# EAGLE design drivebay pm (EAGLE 5.11)

## Sheet 1 of 4
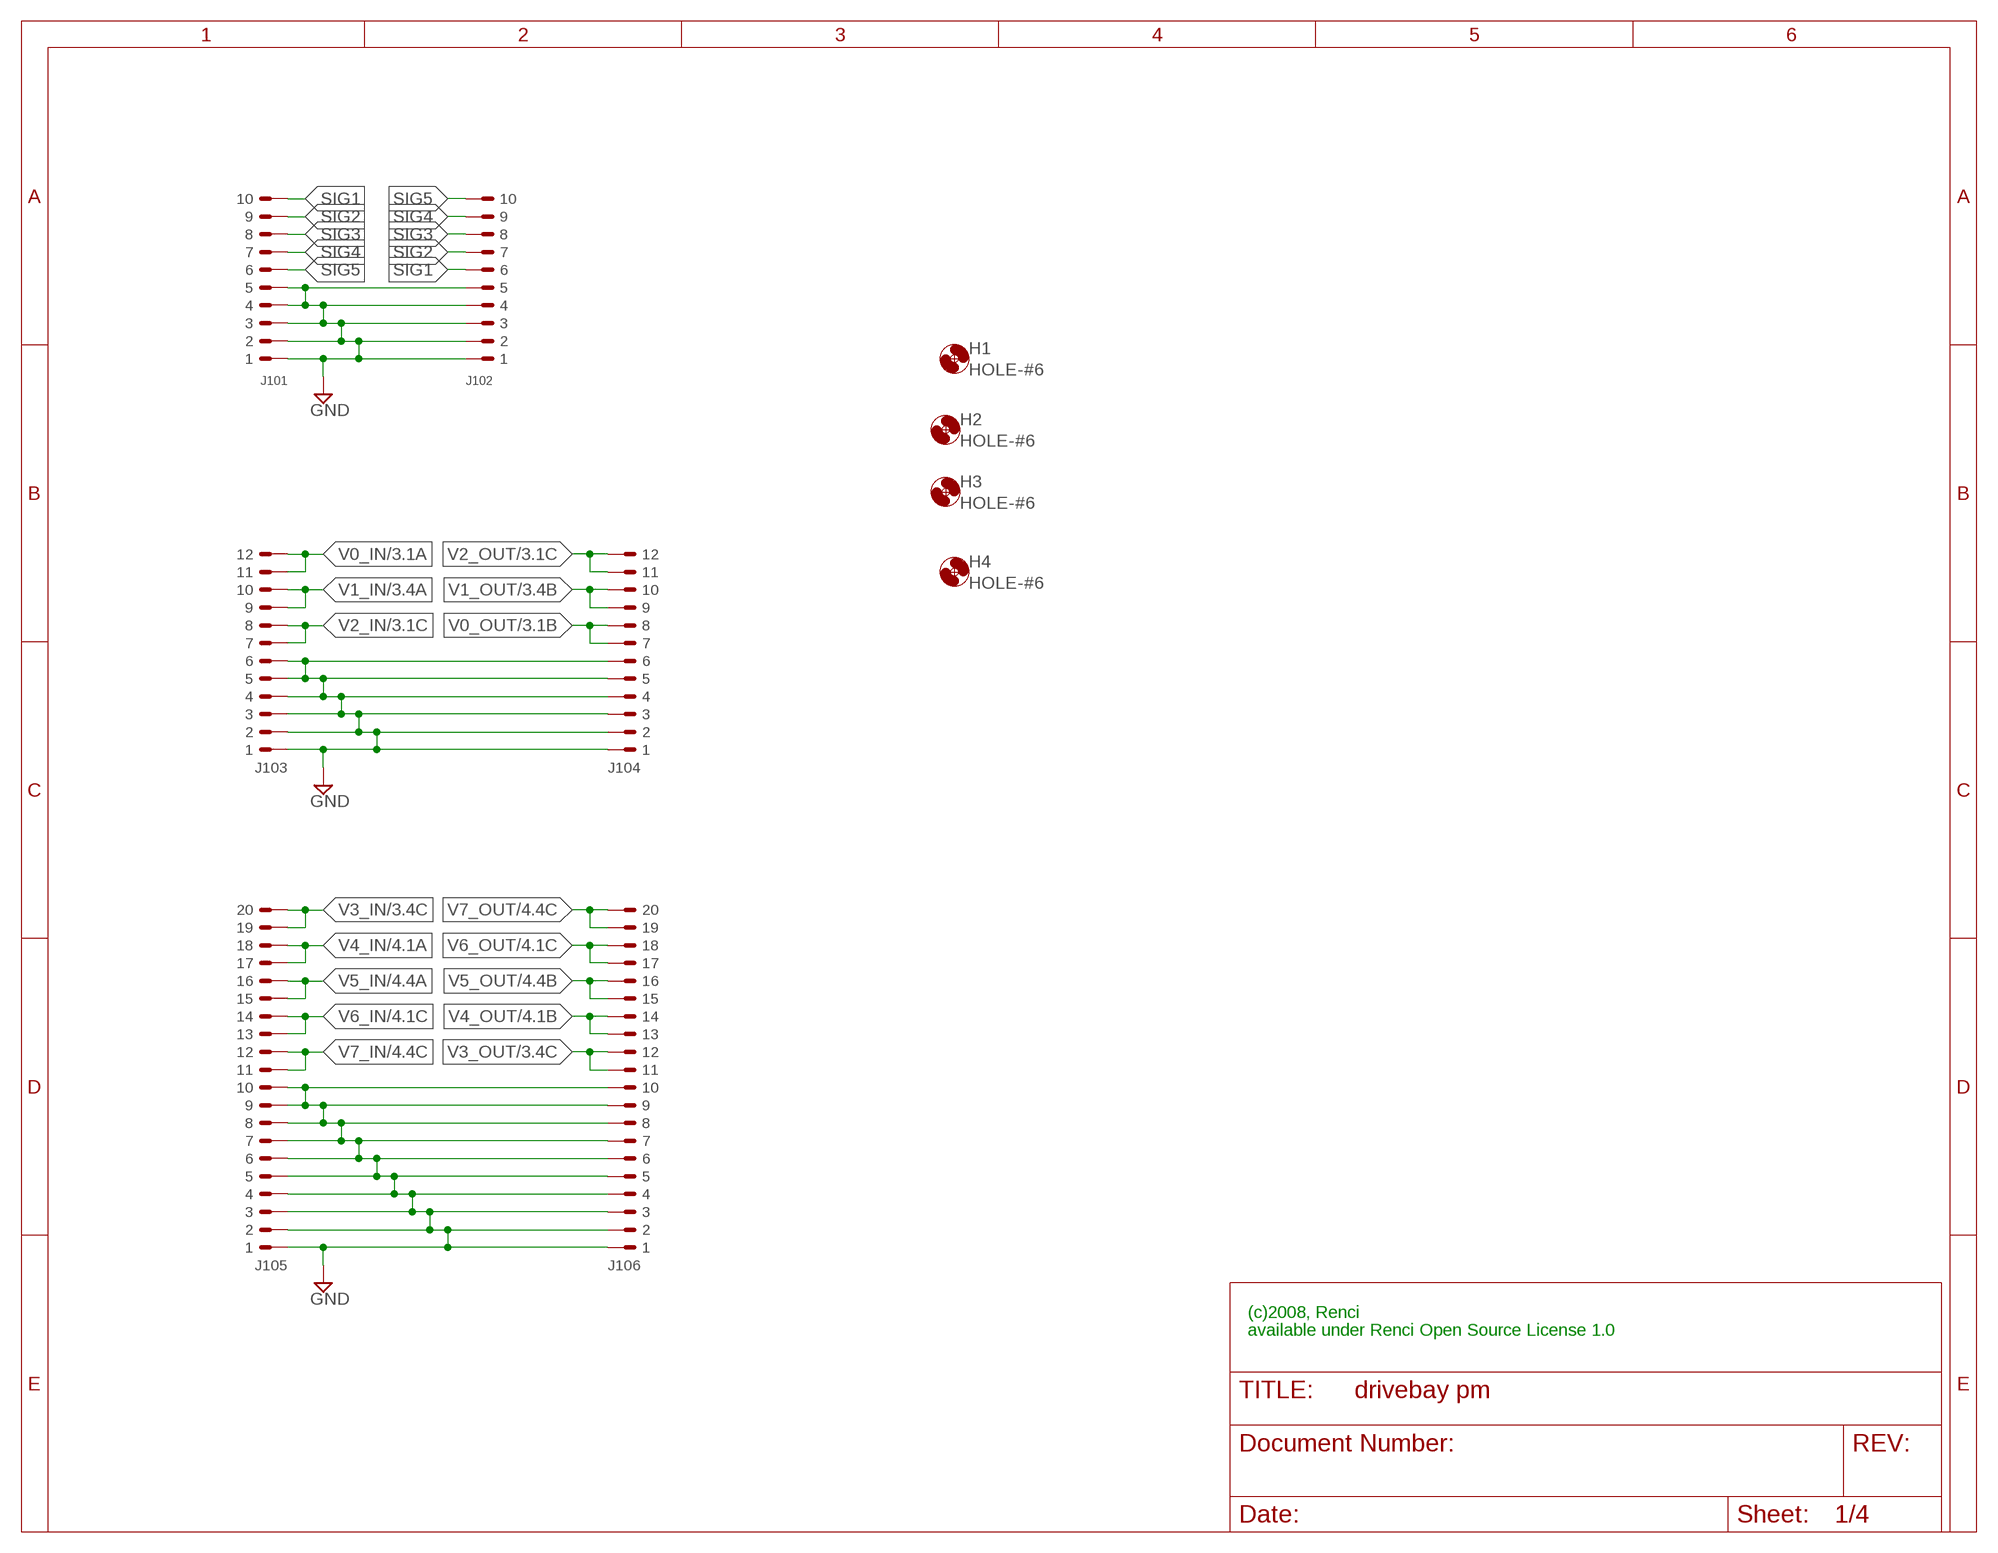
[diagram p0: schematic, sheet 1]

### Parts
H1  HOLE-#6  [HOLE-#6]
H2  HOLE-#6  [HOLE-#6]
H3  HOLE-#6  [HOLE-#6]
H4  HOLE-#6  [HOLE-#6]
J101  43045-10?  43045-10  [43045-10??]
J102  43045-10?  43045-10  [43045-10??]
J103  43045-12?  43045-12  [43045-12??]
J104  43045-12?  43045-12  [43045-12??]
J105  43045-20?  43045-20  [43045-20??]
J106  43045-20?  43045-20  [43045-20??]

### Nets
GND: J101.1 J101.2 J101.3 J101.4 J101.5 J102.1 J102.2 J102.3 J102.4 J102.5 J103.1 J103.2 J103.3 J103.4 J103.5 J103.6 J104.1 J104.2 J104.3 J104.4 J104.5 J104.6 J105.1 J105.2 J105.3 J105.4 J105.5 J105.6 J105.7 J105.8 J105.9 J105.10 J106.1 J106.2 J106.3 J106.4 J106.5 J106.6 J106.7 J106.8 J106.9 J106.10 ; also sheet 2,3,4
SIG1: J101.10 J102.6
SIG2: J101.9 J102.7
SIG3: J101.8 J102.8
SIG4: J101.7 J102.9
SIG5: J101.6 J102.10
V0_IN: J103.11 J103.12 ; also sheet 3
V0_OUT: J104.7 J104.8 ; also sheet 3
V1_IN: J103.9 J103.10 ; also sheet 3
V1_OUT: J104.9 J104.10 ; also sheet 3
V2_IN: J103.7 J103.8 ; also sheet 3
V2_OUT: J104.11 J104.12 ; also sheet 3
V3_IN: J105.19 J105.20 ; also sheet 3
V3_OUT: J106.11 J106.12 ; also sheet 3
V4_IN: J105.17 J105.18 ; also sheet 4
V4_OUT: J106.13 J106.14 ; also sheet 4
V5_IN: J105.15 J105.16 ; also sheet 4
V5_OUT: J106.15 J106.16 ; also sheet 4
V6_IN: J105.13 J105.14 ; also sheet 4
V6_OUT: J106.17 J106.18 ; also sheet 4
V7_IN: J105.11 J105.12 ; also sheet 4
V7_OUT: J106.19 J106.20 ; also sheet 4

### Notes on the sheet
- (c)2008, Renci
- available under Renci Open Source License 1.0

## Sheet 2 of 4
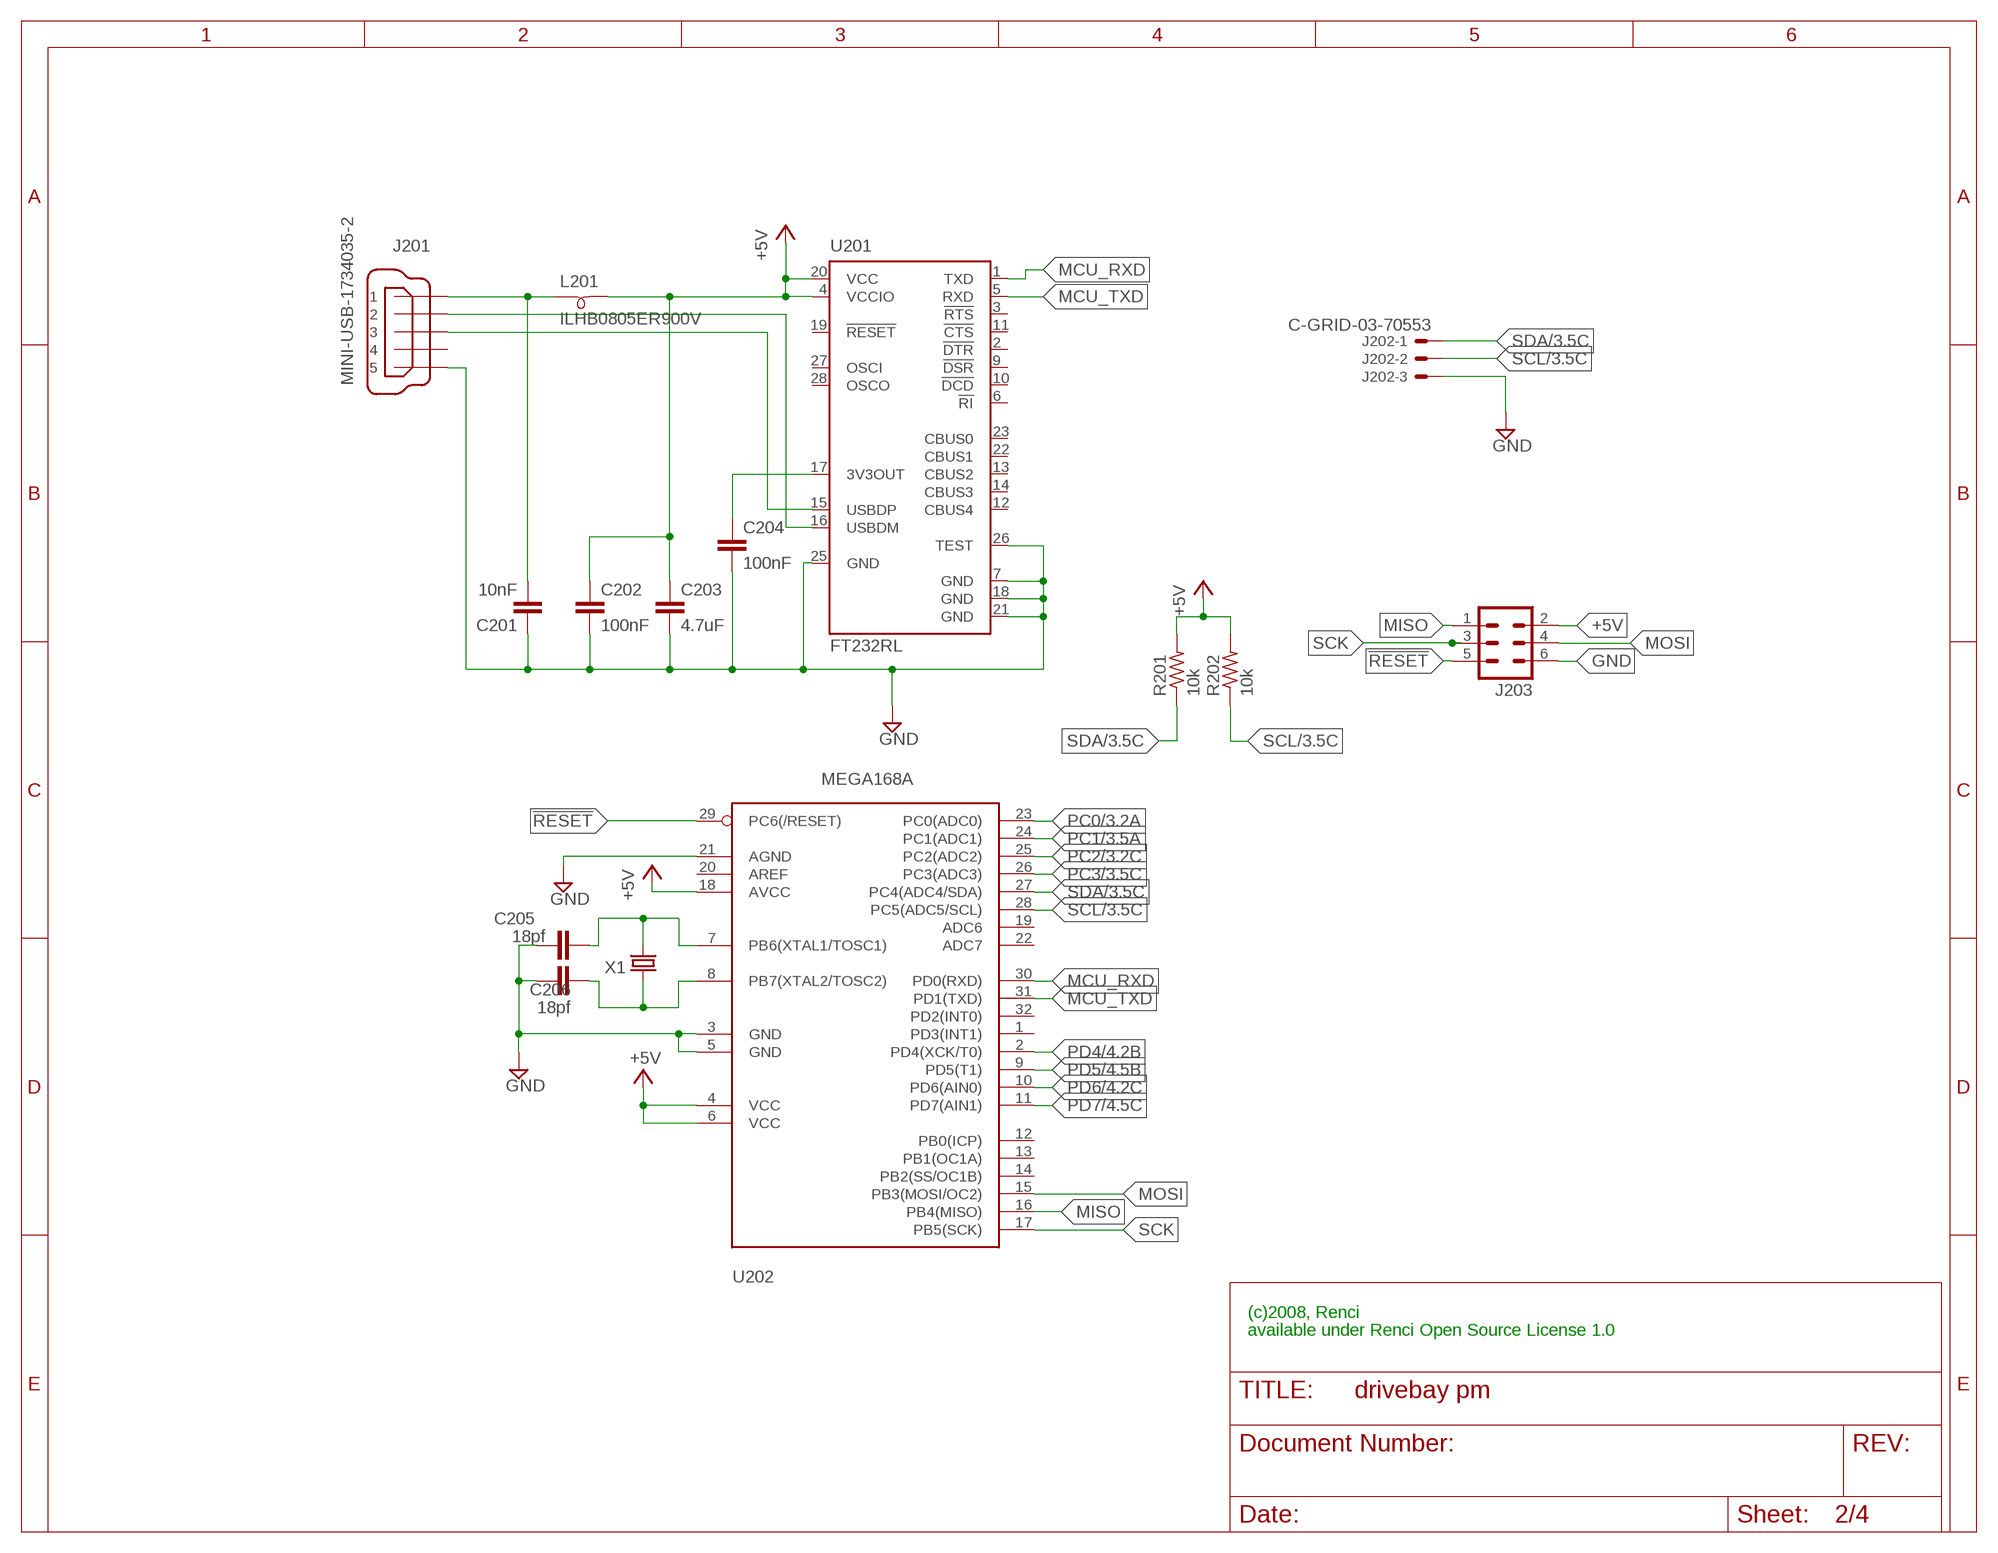
[diagram p1: schematic, sheet 2]

### Parts
C201  10nF  C-EUC0805  [C0805]
C202  100nF  C-EUC0805  [C0805]
C203  4.7uF  C-EUC0805  [C0805]
C204  100nF  C-EUC0805  [C0805]
C205  18pf  C-EUC0805  [C0805]
C206  18pf  C-EUC0805  [C0805]
J201  MINI-USB-1734035-2  [1734035-2]
J202  C-GRID-03-70553  [70553-03]
J203  MA03-2  [MA03-2]
L201  ILHB0805ER900V  [L0805]
R201  10k  R-US_R0805  [R0805]
R202  10k  R-US_R0805  [R0805]
U201  FT232RL  [SSOP28]
U202  MEGA168A  [TQFP32-08]
X1  MC-306  [MC-306]

### Nets
!RESET: J203.5 U202.29(PC6(/RESET))
+5V: C202.1 C203.1 J203.2 L201.2 R201.2 R202.2 U201.4(VCCIO) U201.20(VCC) U202.4(VCC) U202.6(VCC) U202.18(AVCC) ; also sheet 3,4
GND: C201.1 C202.2 C203.2 C204.2 C205.2 C206.2 J201.5 J202.3 J203.6 U201.7(GND) U201.18(GND) U201.21(GND) U201.25(GND) U201.26(TEST) U202.3(GND) U202.5(GND) U202.21(AGND) ; also sheet 1,3,4
MCU_RXD: U201.1(TXD) U202.30(PD0(RXD))
MCU_TXD: U201.5(RXD) U202.31(PD1(TXD))
MISO: J203.1 U202.16(PB4(MISO))
MOSI: J203.4 U202.15(PB3(MOSI/OC2))
N$12: C204.1 U201.17(3V3OUT)
N$13: C201.2 J201.1 L201.1
N$14: J201.2 U201.16(USBDM)
N$15: J201.3 U201.15(USBDP)
N$16: C205.1 U202.7(PB6(XTAL1/TOSC1)) X1.4
N$17: C206.1 U202.8(PB7(XTAL2/TOSC2)) X1.1
PC0: U202.23(PC0(ADC0)) ; also sheet 3
PC1: U202.24(PC1(ADC1)) ; also sheet 3
PC2: U202.25(PC2(ADC2)) ; also sheet 3
PC3: U202.26(PC3(ADC3)) ; also sheet 3
PD4: U202.2(PD4(XCK/T0)) ; also sheet 4
PD5: U202.9(PD5(T1)) ; also sheet 4
PD6: U202.10(PD6(AIN0)) ; also sheet 4
PD7: U202.11(PD7(AIN1)) ; also sheet 4
SCK: J203.3 U202.17(PB5(SCK))
SCL: J202.2 R202.1 U202.28(PC5(ADC5/SCL)) ; also sheet 3,4
SDA: J202.1 R201.1 U202.27(PC4(ADC4/SDA)) ; also sheet 3,4
Unconnected: J201.4 U201.2(!DTR) U201.3(!RTS) U201.6(!RI) U201.9(!DSR) U201.10(!DCD) U201.11(!CTS) U201.12(CBUS4) U201.13(CBUS2) U201.14(CBUS3) U201.19(!RESET) U201.22(CBUS1) U201.23(CBUS0) U201.27(OSCI) U201.28(OSCO) U202.1(PD3(INT1)) U202.12(PB0(ICP)) U202.13(PB1(OC1A)) U202.14(PB2(SS/OC1B)) U202.19(ADC6) U202.20(AREF) U202.22(ADC7) U202.32(PD2(INT0))

### Notes on the sheet
- (c)2008, Renci
- available under Renci Open Source License 1.0

## Sheet 3 of 4
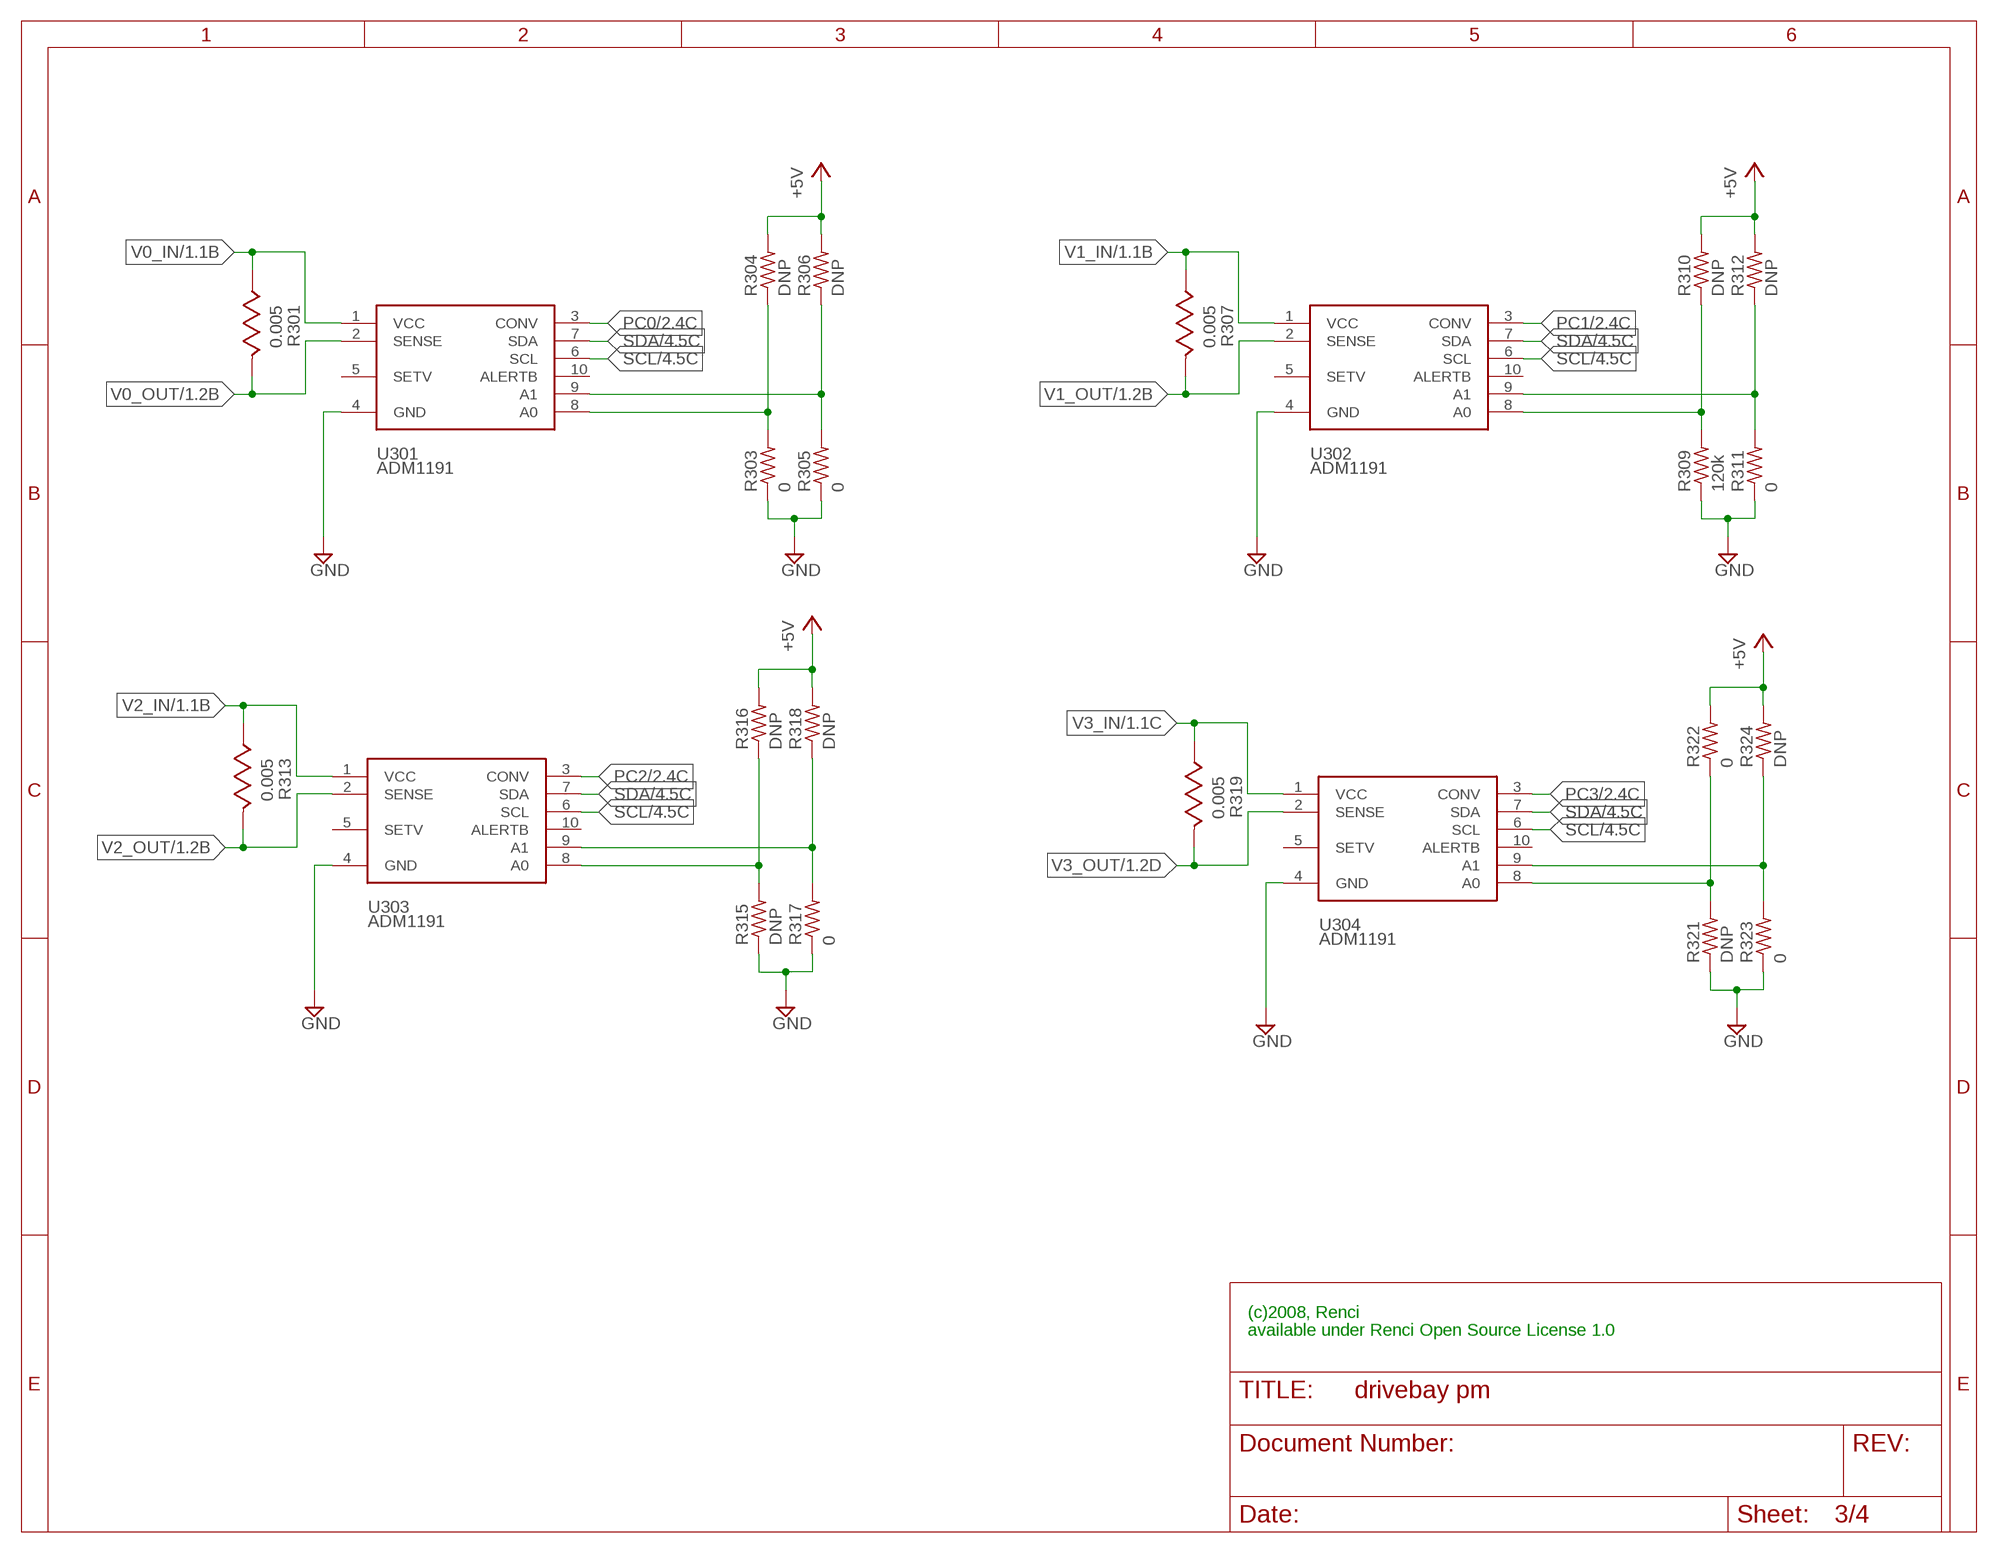
[diagram p2: schematic, sheet 3]

### Parts
R301  0.005  OARS-XP  [OARS-XP]
R303  0  R-US_R0603  [R0603]
R304  DNP  R-US_R0603  [R0603]
R305  0  R-US_R0603  [R0603]
R306  DNP  R-US_R0603  [R0603]
R307  0.005  OARS-XP  [OARS-XP]
R309  120k  R-US_R0603  [R0603]
R310  DNP  R-US_R0603  [R0603]
R311  0  R-US_R0603  [R0603]
R312  DNP  R-US_R0603  [R0603]
R313  0.005  OARS-XP  [OARS-XP]
R315  DNP  R-US_R0603  [R0603]
R316  DNP  R-US_R0603  [R0603]
R317  0  R-US_R0603  [R0603]
R318  DNP  R-US_R0603  [R0603]
R319  0.005  OARS-XP  [OARS-XP]
R321  DNP  R-US_R0603  [R0603]
R322  0  R-US_R0603  [R0603]
R323  0  R-US_R0603  [R0603]
R324  DNP  R-US_R0603  [R0603]
U301  ADM1191  [MSOP10]
U302  ADM1191  [MSOP10]
U303  ADM1191  [MSOP10]
U304  ADM1191  [MSOP10]

### Nets
+5V: R304.2 R306.2 R310.2 R312.2 R316.2 R318.2 R322.2 R324.2 ; also sheet 2,4
GND: R303.1 R305.1 R309.1 R311.1 R315.1 R317.1 R321.1 R323.1 U301.4(GND) U302.4(GND) U303.4(GND) U304.4(GND) ; also sheet 1,2,4
N$7: R315.2 R316.1 U303.8(A0)
N$9: R303.2 R304.1 U301.8(A0)
N$10: R305.2 R306.1 U301.9(A1)
N$11: R317.2 R318.1 U303.9(A1)
N$19: R321.2 R322.1 U304.8(A0)
N$20: R323.2 R324.1 U304.9(A1)
N$22: R309.2 R310.1 U302.8(A0)
N$23: R311.2 R312.1 U302.9(A1)
PC0: U301.3(CONV) ; also sheet 2
PC1: U302.3(CONV) ; also sheet 2
PC2: U303.3(CONV) ; also sheet 2
PC3: U304.3(CONV) ; also sheet 2
SCL: U301.6(SCL) U302.6(SCL) U303.6(SCL) U304.6(SCL) ; also sheet 2,4
SDA: U301.7(SDA) U302.7(SDA) U303.7(SDA) U304.7(SDA) ; also sheet 2,4
V0_IN: R301.P$1(A) U301.1(VCC) ; also sheet 1
V0_OUT: R301.P$2(E) U301.2(SENSE) ; also sheet 1
V1_IN: R307.P$1(A) U302.1(VCC) ; also sheet 1
V1_OUT: R307.P$2(E) U302.2(SENSE) ; also sheet 1
V2_IN: R313.P$1(A) U303.1(VCC) ; also sheet 1
V2_OUT: R313.P$2(E) U303.2(SENSE) ; also sheet 1
V3_IN: R319.P$1(A) U304.1(VCC) ; also sheet 1
V3_OUT: R319.P$2(E) U304.2(SENSE) ; also sheet 1
Unconnected: U301.5(SETV) U301.10(ALERTB) U302.5(SETV) U302.10(ALERTB) U303.5(SETV) U303.10(ALERTB) U304.5(SETV) U304.10(ALERTB)

### Notes on the sheet
- (c)2008, Renci
- available under Renci Open Source License 1.0

## Sheet 4 of 4
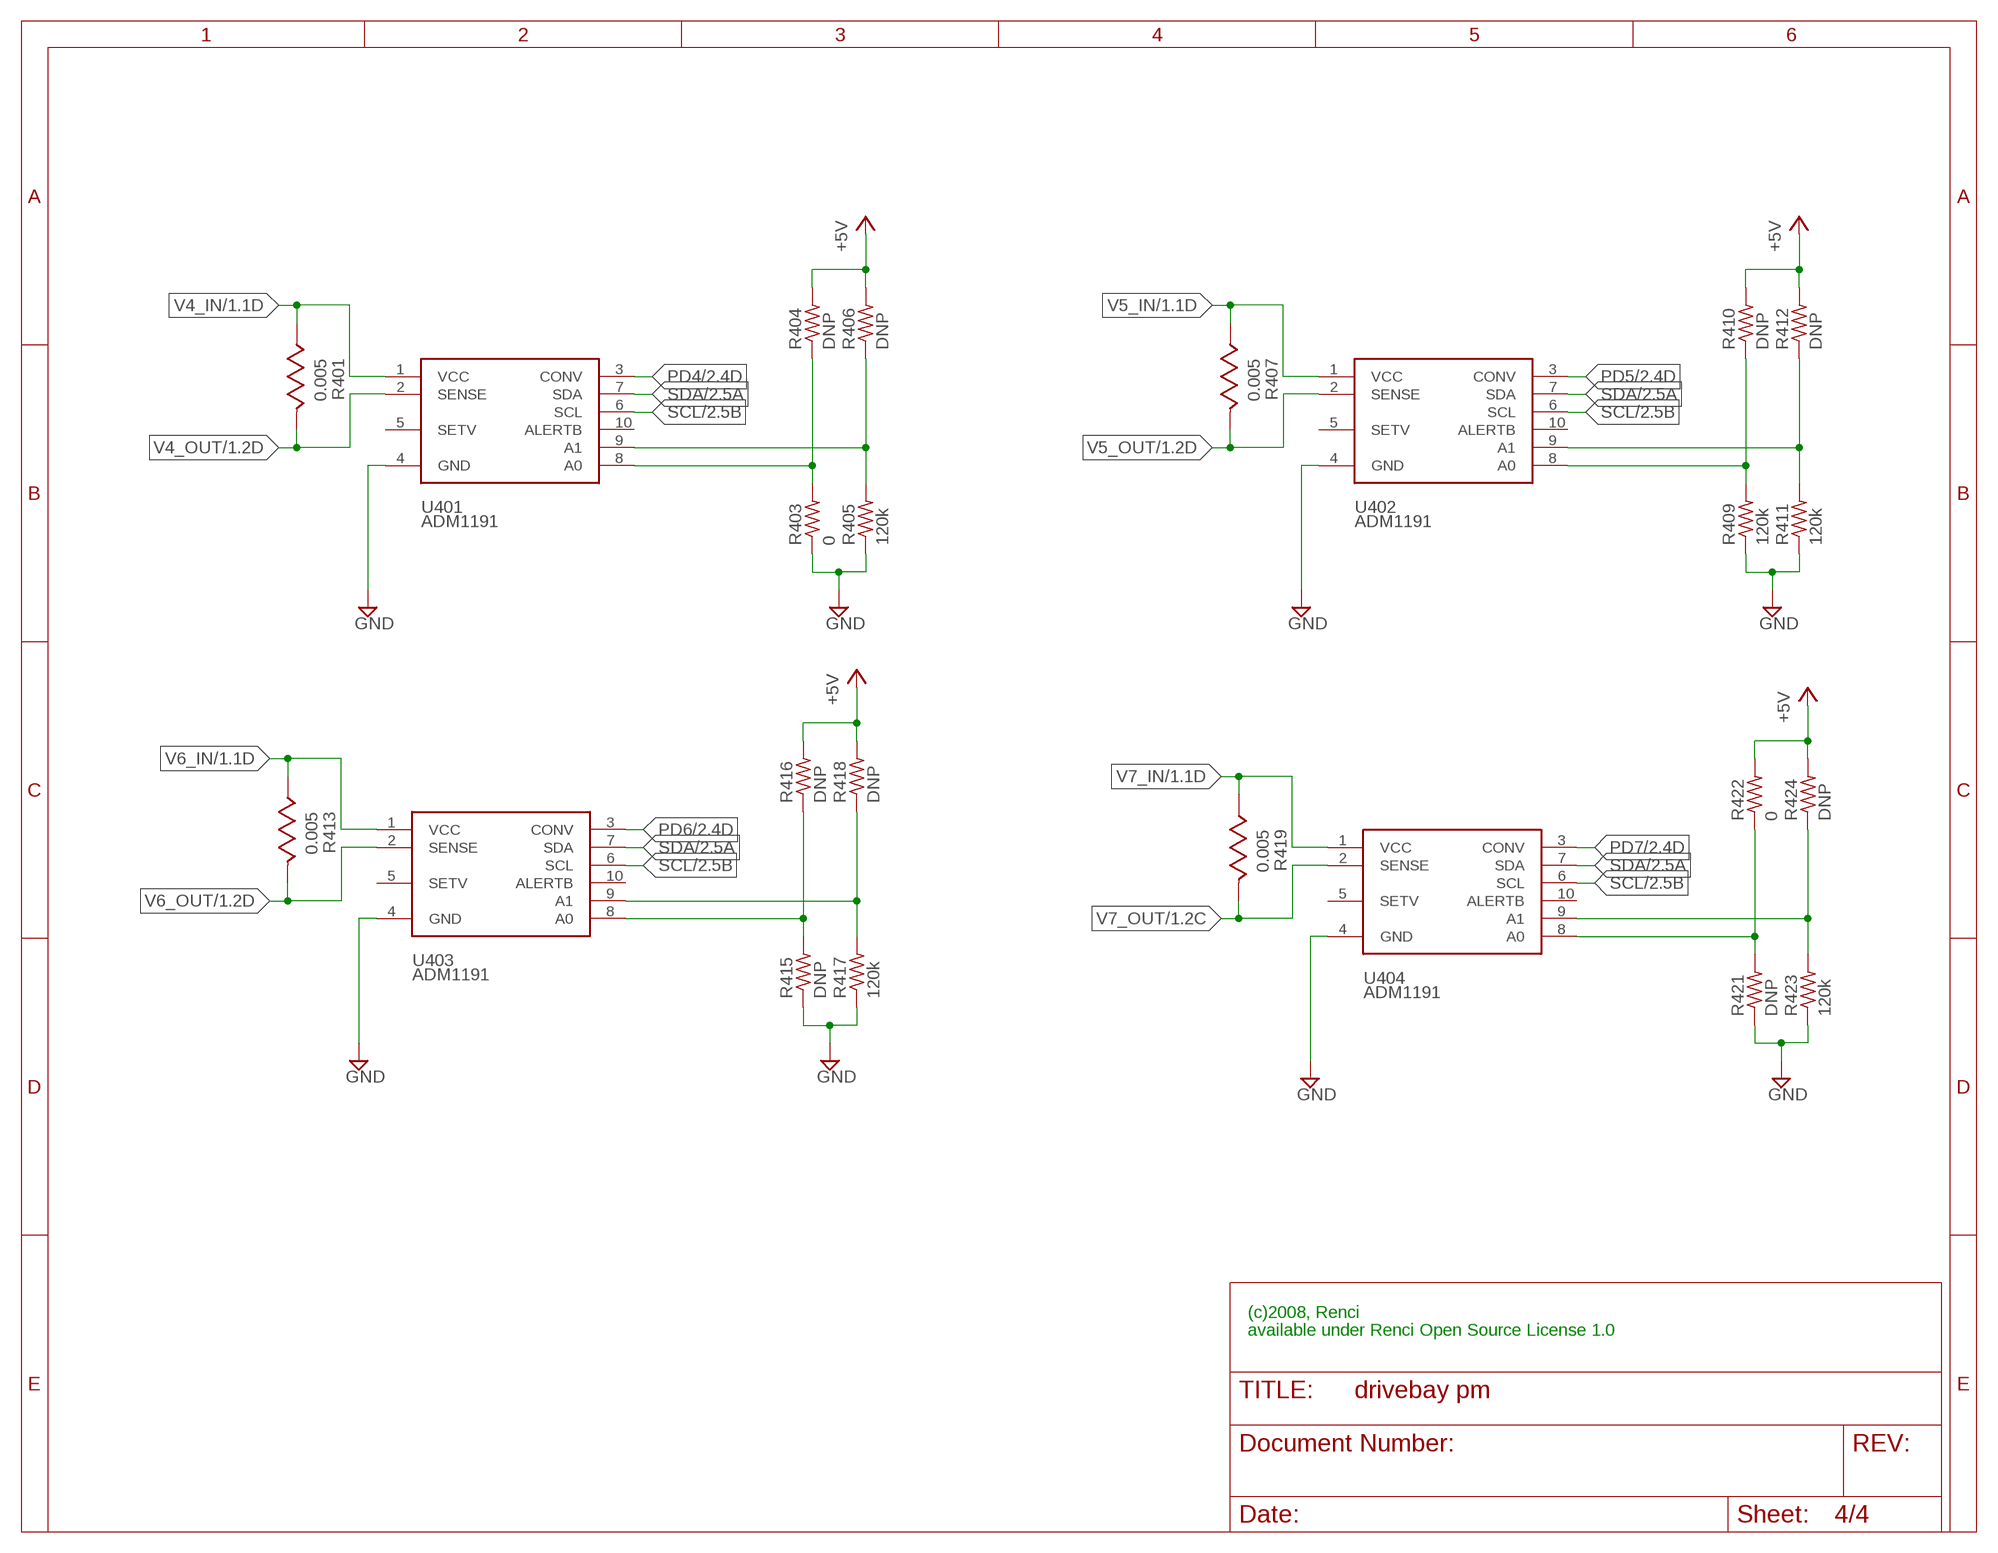
[diagram p3: schematic, sheet 4]

### Parts
R401  0.005  OARS-XP  [OARS-XP]
R403  0  R-US_R0603  [R0603]
R404  DNP  R-US_R0603  [R0603]
R405  120k  R-US_R0603  [R0603]
R406  DNP  R-US_R0603  [R0603]
R407  0.005  OARS-XP  [OARS-XP]
R409  120k  R-US_R0603  [R0603]
R410  DNP  R-US_R0603  [R0603]
R411  120k  R-US_R0603  [R0603]
R412  DNP  R-US_R0603  [R0603]
R413  0.005  OARS-XP  [OARS-XP]
R415  DNP  R-US_R0603  [R0603]
R416  DNP  R-US_R0603  [R0603]
R417  120k  R-US_R0603  [R0603]
R418  DNP  R-US_R0603  [R0603]
R419  0.005  OARS-XP  [OARS-XP]
R421  DNP  R-US_R0603  [R0603]
R422  0  R-US_R0603  [R0603]
R423  120k  R-US_R0603  [R0603]
R424  DNP  R-US_R0603  [R0603]
U401  ADM1191  [MSOP10]
U402  ADM1191  [MSOP10]
U403  ADM1191  [MSOP10]
U404  ADM1191  [MSOP10]

### Nets
+5V: R404.2 R406.2 R410.2 R412.2 R416.2 R418.2 R422.2 R424.2 ; also sheet 2,3
GND: R403.1 R405.1 R409.1 R411.1 R415.1 R417.1 R421.1 R423.1 U401.4(GND) U402.4(GND) U403.4(GND) U404.4(GND) ; also sheet 1,2,3
N$25: R403.2 R404.1 U401.8(A0)
N$26: R405.2 R406.1 U401.9(A1)
N$28: R415.2 R416.1 U403.8(A0)
N$29: R417.2 R418.1 U403.9(A1)
N$31: R421.2 R422.1 U404.8(A0)
N$32: R423.2 R424.1 U404.9(A1)
N$34: R409.2 R410.1 U402.8(A0)
N$35: R411.2 R412.1 U402.9(A1)
PD4: U401.3(CONV) ; also sheet 2
PD5: U402.3(CONV) ; also sheet 2
PD6: U403.3(CONV) ; also sheet 2
PD7: U404.3(CONV) ; also sheet 2
SCL: U401.6(SCL) U402.6(SCL) U403.6(SCL) U404.6(SCL) ; also sheet 2,3
SDA: U401.7(SDA) U402.7(SDA) U403.7(SDA) U404.7(SDA) ; also sheet 2,3
V4_IN: R401.P$1(A) U401.1(VCC) ; also sheet 1
V4_OUT: R401.P$2(E) U401.2(SENSE) ; also sheet 1
V5_IN: R407.P$1(A) U402.1(VCC) ; also sheet 1
V5_OUT: R407.P$2(E) U402.2(SENSE) ; also sheet 1
V6_IN: R413.P$1(A) U403.1(VCC) ; also sheet 1
V6_OUT: R413.P$2(E) U403.2(SENSE) ; also sheet 1
V7_IN: R419.P$1(A) U404.1(VCC) ; also sheet 1
V7_OUT: R419.P$2(E) U404.2(SENSE) ; also sheet 1
Unconnected: U401.5(SETV) U401.10(ALERTB) U402.5(SETV) U402.10(ALERTB) U403.5(SETV) U403.10(ALERTB) U404.5(SETV) U404.10(ALERTB)

### Notes on the sheet
- (c)2008, Renci
- available under Renci Open Source License 1.0

## Library data of the parts
C201-C206 = rcl:C-EU: CAPACITOR, European symbol
H1-H4 = renci:HOLE-#6
J101 J102 = renci:43045-10??
J103 J104 = renci:43045-12??
J105 J106 = renci:43045-20??
J201 = renci:MINI-USB-: MINI USB Connector Source: http://www.hirose.co.jp/cataloge_hp/e24000019.pdf
J202 = con-molex:C-GRID-03: CONNECTOR wire to board 2.54 mm (0.100") pitch header
J203 = con-lstb:MA03-2: PIN HEADER
L201 = renci:ILHB0805ER900V
R201 R202 R303-R306 R309-R312 R315-R318 R321-R324 R403-R406 R409-R412 R415-R418 R421-R424 = resistor:R-US_: RESISTOR, American symbol
R301 R307 R313 R319 R401 R407 R413 R419 = renci:OARS-XP
U201 = ftdichip:FT232R: Source: http://www.ftdichip.com/Documents/DataSheets/DS_FT232R_v104.pdf
U202 = renci:MEGA168
U301-U304 U401-U404 = renci:ADM1191
X1 = crystal:MC-306: kHz RANGE CRYSTAL UNIT SMD Source: MC-306_405_406_E07X.PDF Homepage <www.epsontoyocom.co.jp>; MPN: MC-306 60.0KHZ 100PPM ,12.5PF; OC_FARNELL: 1278040; OC_NEWARK: 31M5576

## Board
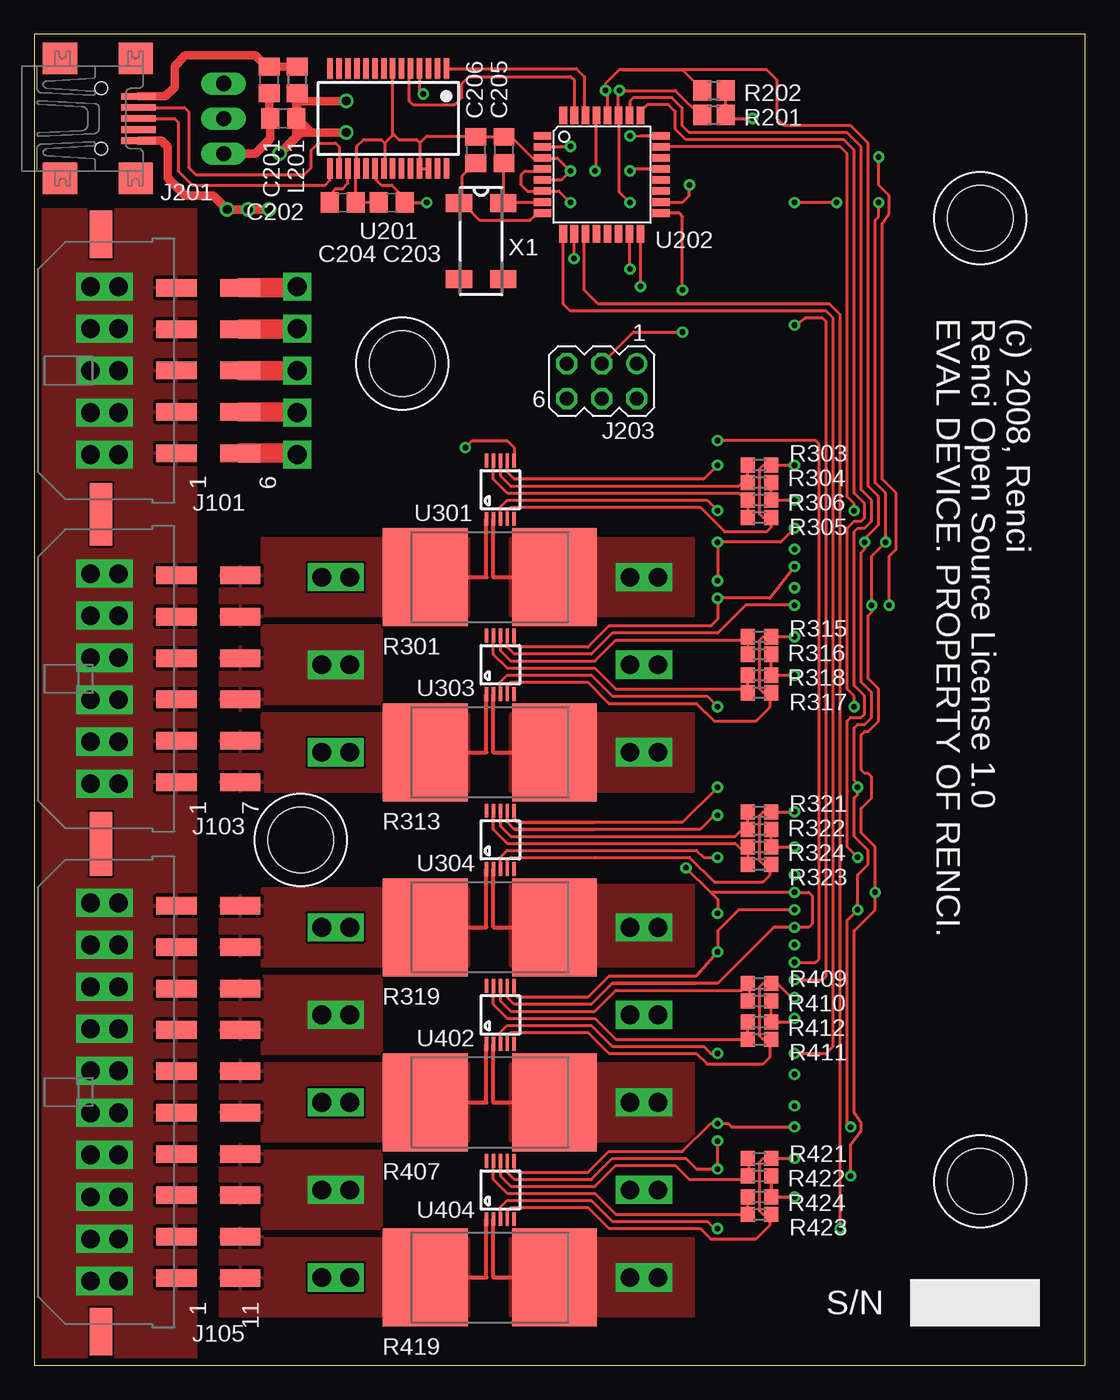
[diagram p4: board, top side]
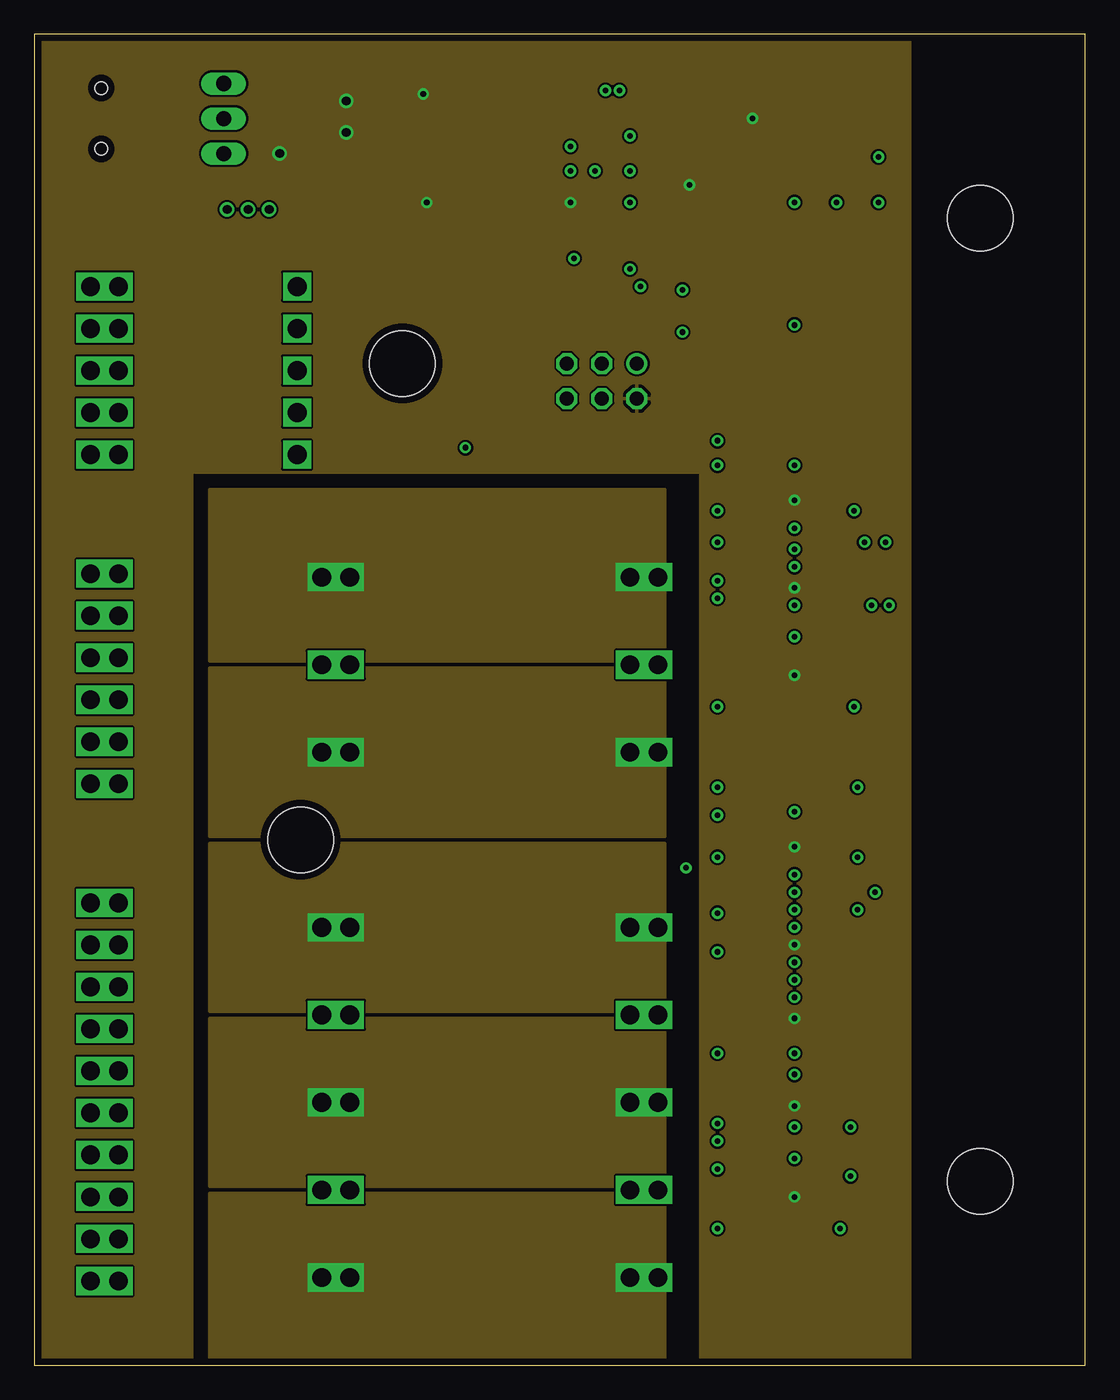
[diagram p5: board, inner layer Route2]
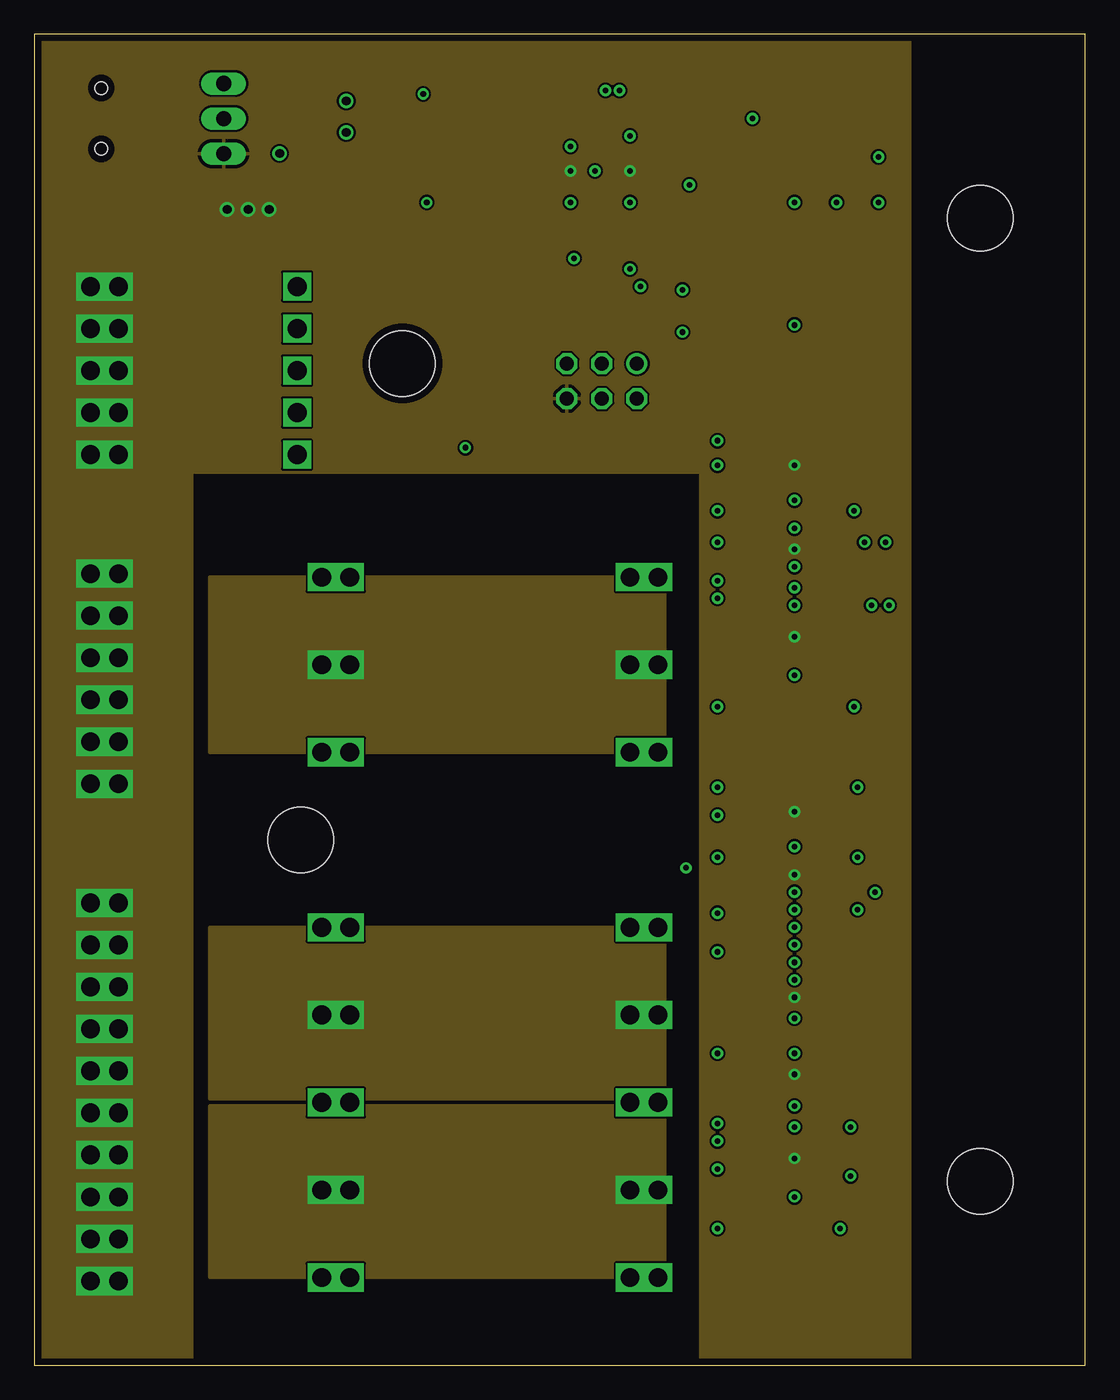
[diagram p6: board, inner layer Route15]
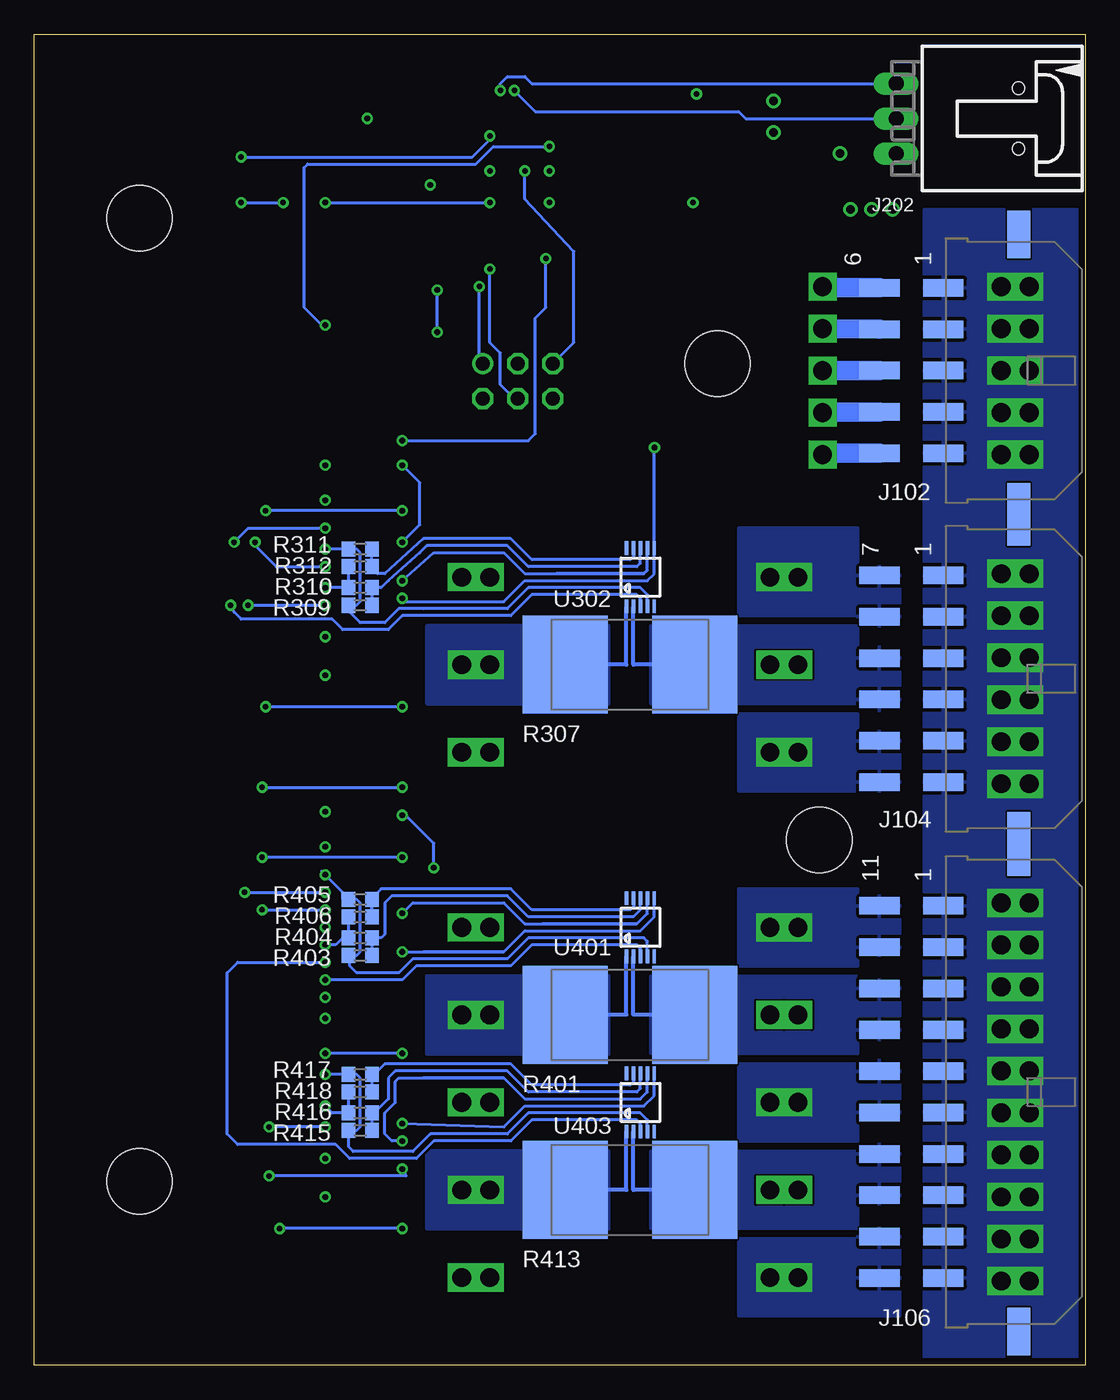
[diagram p7: board, bottom side, seen from below]

Size 76.2 x 96.52 mm. Coordinates in mm from the lower left corner, seen from the top.
Outline: 0,0 76.2,0 76.2,96.52 0,96.52 0,0
Copper layers (1+2*15+16): Top 0.0178mm / dielectric 0.3048mm / Route2 0.0356mm / dielectric 0.7112mm / Route15 0.0356mm / dielectric 0.3048mm / Bottom 0.0178mm
Design rules "SSC-EAGLE-4Lyr_v1.0.0.3 *": minimum track width 6mil, minimum drill 8mil, track to track 6mil, track to pad 6mil, pad to pad 6mil, via to via 6mil, smd to smd 6mil, copper to edge 20mil, drill to drill 16mil, minimum pad ring 8mil, minimum via ring 8mil, stop-mask expansion 2mil, vias tented up to drill 25mil, thermal gap 10mil

### Footprints (pad centres in the part's own frame; a part is rotated, then mirrored left to right if it is on the bottom)
C0805 = smd 1.3 x 1.5: 1 -0.95,0; 2 0.95,0
HOLE-#6 = hole 4.75: 0,0
43045-10?? = smd 1.27 x 2.92: 1 6,5.47; 2 3,5.47; 3 0,5.47; 4 -3,5.47; 5 -6,5.47; 6 6,10.1; 7 3,10.1; 8 0,10.1; 9 -3,10.1; 10 -6,10.1 | smd 3.43 x 1.65: P$1 -9.885,0; P$2 9.885,0
43045-12?? = smd 1.27 x 2.92: 1 7.5,5.47; 2 4.5,5.47; 3 1.5,5.47; 4 -1.5,5.47; 5 -4.5,5.47; 6 -7.5,5.47; 7 7.5,10.1; 8 4.5,10.1; 9 1.5,10.1; 10 -1.5,10.1; 11 -4.5,10.1; 12 -7.5,10.1 | smd 3.43 x 1.65: P$1 -11.385,0; P$2 11.385,0
43045-20?? = smd 1.27 x 2.92: 1 13.5,5.47; 2 10.5,5.47; 3 7.5,5.47; 4 4.5,5.47; 5 1.5,5.47; 6 -1.5,5.47; 7 -4.5,5.47; 8 -7.5,5.47; 9 -10.5,5.47; 10 -13.5,5.47; 11 13.5,10.1; 12 10.5,10.1; 13 7.5,10.1; 14 4.5,10.1; 15 1.5,10.1; 16 -1.5,10.1; 17 -4.5,10.1; 18 -7.5,10.1; 19 -10.5,10.1; 20 -13.5,10.1 | smd 3.43 x 1.65: P$1 -17.385,0; P$2 17.385,0
1734035-2 = smd 2.5 x 0.5: 1 3.48,1.6; 2 3.48,0.8; 3 3.48,0; 4 3.48,-0.8; 5 3.48,-1.6 | smd 2.5 x 2.3: M1 -2.22,-4.35; M2 -2.22,4.35; M3 3.28,4.35; M4 3.28,-4.35 | hole 0.9: 0.78,-2.2; 0.78,2.2
70553-03 = drill 1.092 long: 1 -2.54,-7.62; 2 0,-7.62; 3 2.54,-7.62
MA03-2 = drill 1.016 round: 1 -2.54,-1.27 | drill 1.016 octagon: 2 -2.54,1.27; 3 0,-1.27; 4 0,1.27; 5 2.54,-1.27; 6 2.54,1.27
L0805 = smd 1.3 x 1.5: 1 -0.95,0; 2 0.95,0
R0805 = smd 1.3 x 1.5: 1 -0.85,0; 2 0.85,0
OARS-XP = smd 6.15 x 7.11: P$1 -4.69,0; P$2 4.69,0
R0603 = smd 1 x 1.1: 1 -0.85,0; 2 0.85,0
SSOP28 = smd 0.4 x 1.5: 1 -4.225,-3.625; 2 -3.575,-3.625; 3 -2.925,-3.625; 4 -2.275,-3.625; 5 -1.625,-3.625; 6 -0.975,-3.625; 7 -0.325,-3.625; 8 0.325,-3.625; 9 0.975,-3.625; 10 1.625,-3.625; 11 2.275,-3.625; 12 2.925,-3.625; 13 3.575,-3.625; 14 4.225,-3.625; 15 4.225,3.625; 16 3.575,3.625; 17 2.925,3.625; 18 2.275,3.625; 19 1.625,3.625; 20 0.975,3.625; 21 0.325,3.625; 22 -0.325,3.625; 23 -0.975,3.625; 24 -1.625,3.625; 25 -2.275,3.625; 26 -2.925,3.625; 27 -3.575,3.625; 28 -4.225,3.625
TQFP32-08 = smd 1.27 x 0.559: 1 -4.293,2.8; 2 -4.293,2; 3 -4.293,1.2; 4 -4.293,0.4; 5 -4.293,-0.4; 6 -4.293,-1.2; 7 -4.293,-2; 8 -4.293,-2.8; 17 4.293,-2.8; 18 4.293,-2; 19 4.293,-1.2; 20 4.293,-0.4; 21 4.293,0.4; 22 4.293,1.2; 23 4.293,2; 24 4.293,2.8 | smd 0.559 x 1.27: 9 -2.8,-4.293; 10 -2,-4.293; 11 -1.2,-4.293; 12 -0.4,-4.293; 13 0.4,-4.293; 14 1.2,-4.293; 15 2,-4.293; 16 2.8,-4.293; 25 2.8,4.293; 26 2,4.293; 27 1.2,4.293; 28 0.4,4.293; 29 -0.4,4.293; 30 -1.2,4.293; 31 -2,4.293; 32 -2.8,4.293
MSOP10 = smd 0.25 x 1: 1 -1,-2.113; 2 -0.5,-2.113; 3 0,-2.113; 4 0.5,-2.113; 5 1,-2.113; 6 1,2.113; 7 0.5,2.113; 8 0,2.113; 9 -0.5,2.113; 10 -1,2.113
MC-306 = smd 1.3 x 1.9: 1 -2.75,-1.6; 2 2.75,-1.6; 3 2.75,1.6; 4 -2.75,1.6

### Placement (x,y rotation side)
C201  17.02,93.22 90 top
C202  18.03,90.42 180 top
C203  25.91,84.33 180 top
C204  22.35,84.33 0 top
C205  34.04,88.14 90 top
C206  32,88.14 90 top
H1  68.58,83.19 0 top
H2  68.58,13.34 0 top
H3  26.67,72.64 0 top
H4  19.3,38.1 0 top
J101  4.83,72.14 270 top
J102  4.83,72.14 90 bottom
J103  4.83,49.78 270 top
J104  4.83,49.78 90 bottom
J105  4.83,19.81 270 top
J106  4.83,19.81 90 bottom
J201  4.06,90.42 0 top
J202  6.1,90.42 270 bottom
J203  41.15,71.37 180 top
L201  19.05,93.22 270 top
R201  49.28,90.68 0 top
R202  49.28,92.46 0 top
R301  33.02,57.15 0 top
R303  52.58,65.28 180 top
R304  52.58,64.01 0 top
R305  52.58,61.47 180 top
R306  52.58,62.74 0 top
R307  33.02,50.8 0 bottom
R309  52.58,55.12 0 bottom
R310  52.58,56.39 180 bottom
R311  52.58,59.18 0 bottom
R312  52.58,57.91 180 bottom
R313  33.02,44.45 0 top
R315  52.58,52.83 180 top
R316  52.58,51.56 0 top
R317  52.58,48.77 180 top
R318  52.58,50.04 0 top
R319  33.02,31.75 0 top
R321  52.58,40.13 180 top
R322  52.58,38.86 0 top
R323  52.58,36.32 180 top
R324  52.58,37.59 0 top
R401  33.02,25.4 0 bottom
R403  52.58,29.72 0 bottom
R404  52.58,30.99 180 bottom
R405  52.58,33.78 0 bottom
R406  52.58,32.51 180 bottom
R407  33.02,19.05 0 top
R409  52.58,27.69 180 top
R410  52.58,26.42 0 top
R411  52.58,23.62 180 top
R412  52.58,24.89 0 top
R413  33.02,12.7 0 bottom
R415  52.58,17.02 0 bottom
R416  52.58,18.29 180 bottom
R417  52.58,21.08 0 bottom
R418  52.58,19.81 180 bottom
R419  33.02,6.35 0 top
R421  52.58,14.99 180 top
R422  52.58,13.72 0 top
R423  52.58,10.92 180 top
R424  52.58,12.19 0 top
U201  25.65,90.42 180 top
U202  41.15,86.36 0 top
U301  33.78,63.5 0 top
U302  32.26,57.15 0 bottom
U303  33.78,50.8 0 top
U304  33.78,38.1 0 top
U401  32.26,31.75 0 bottom
U402  33.78,25.4 0 top
U403  32.26,19.05 0 bottom
U404  33.78,12.7 0 top
X1  32.38,81.53 270 top

### Tracks (layer width: path | path; a pad name or v marks a point on that pad's centre or on a via)
!RESET  (via drill 0.41)
  Top 0.203: U202.29 40.75,86.98 v40.64,86.61
  Bottom 0.203: v40.64,86.61 40.64,84.58 37.08,80.77 37.08,74.17 J203.5
+5V  (via drill 0.41, 0.64)
  Top 0.203: C203.1 26.86,84.65 26.67,84.84 | 25.15,85.6 24.64,86.11 24.64,86.61 24.68,86.66 U201.20 24.68,86.06 25.15,85.6 | 25.15,85.6 25.91,85.6 26.67,84.84 | 26.67,84.84 26.67,84.33 v28.45,84.33 | U202.4 36.85,86.84 36.83,86.87 36.58,86.61 35.56,86.61 35.31,86.36 35.31,85.6 35.74,85.16 U202.6 38.03,85.16 v38.86,84.33 38.89,84.36 | R201.2 50.13,90.51 | 50.13,90.51 R202.2 | 50.13,90.51 50.04,90.42 v52.07,90.42 | R304.2 53.59,64.01 53.43,63.84 R306.2 v55.12,62.74 | R316.2 53.34,51.56 53.43,51.47 R318.2 v55.12,50.04 | R322.2 53.43,37.93 53.34,37.85 53.43,37.76 R324.2 v55.12,37.59 | R410.2 53.43,25.31 53.59,25.15 53.43,24.98 R412.2 54.86,24.89 v55.12,25.15 | R424.2 53.43,13.55 53.59,13.72 R422.2 53.43,12.28 53.34,12.19 v55.12,12.19 | U201.4 27.93,92.47 v28.19,92.2 | U202.18 47.02,84.36 47.5,84.84 v47.5,85.6
  Top 0.61: 19.05,91.69 L201.2 | 19.05,91.69 18.98,92.14 C202.1 18.98,89.09 v17.78,87.88 19.3,89.41 v22.61,89.41 20.07,89.41 19.05,90.42 19.05,91.69 | 19.05,91.69 v22.61,91.69
  Bottom 0.203: R312.2 53.59,57.91 53.43,57.75 R310.2 v55.12,56.39 | R406.2 53.43,31.41 53.59,31.24 53.43,31.08 R404.2 53.85,30.99 54.36,30.48 v55.12,30.48 | R418.2 53.59,19.81 53.43,19.65 R416.2 54.61,18.29 v55.12,18.8
  pour Route2: 0,0 11.43,0 11.43,64.77 48.26,64.77 48.26,0 63.5,0 63.5,96.52 0,96.52
GND  (via drill 0.41, 0.64, 1.36)
  Top 0.203: U301.4 34.28,61.97 34.54,62.23 48.26,62.23 50.04,60.45 53.09,60.45 53.43,60.79 R305.1 | 34.54,49.53 37.85,49.53 | 34.54,36.83 40.64,36.83 | U402.4 34.28,23.87 34.54,24.13 40.13,24.13 41.66,22.61 48.01,22.61 48.77,21.84 52.83,21.84 53.34,22.35 53.34,23.37 53.43,23.46 R411.1 52.83,23.62 52.58,23.88 52.58,27.43 52.83,27.69 R409.1 53.85,27.69 54.86,26.67 v55.12,26.67 | U404.4 34.28,11.17 34.54,11.43 40.13,11.43 41.66,9.91 48.26,9.91 49.02,9.14 52.32,9.14 53.34,10.16 53.34,10.92 | U303.4 34.28,49.27 34.54,49.53 | 34.54,49.53 40.13,49.53 41.66,48.01 48.01,48.01 49.28,46.74 52.32,46.74 53.34,47.75 53.34,48.77 | U304.4 34.28,36.57 34.54,36.83 | 23.37,86.87 23.37,88.39 | 23.37,86.87 23.38,86.86 U201.18 23.38,88.4 23.88,88.9 25.15,88.9 25.4,88.65 | 23.37,86.87 23.3,86.8 C204.2 C203.2 | 31.82,89.09 C206.2 | 31.82,89.09 C205.2 34.04,89.15 34.54,89.15 36.14,87.56 U202.3 37.92,87.56 | 31.82,89.09 31.75,89.15 28.45,89.15 27.94,88.65 27.93,88.66 | U201.26 28.01,86.8 27.94,86.87 27.93,86.86 U201.25 27.93,88.66 | 25.98,89.22 U201.7 | 25.4,88.65 25.98,89.22 | U201.21 25.4,86.87 25.4,88.65 | 27.93,88.66 27.69,88.9 26.42,88.9 26.09,89.22 25.98,89.22 | 37.92,87.56 38.35,87.12 | 37.92,87.56 v38.86,86.61 38.21,85.96 U202.5 | R305.1 53.59,61.47 | R305.1 52.83,61.47 52.58,61.72 52.58,65.02 52.83,65.28 R303.1 v55.12,65.28 | 53.34,48.77 52.83,48.77 52.58,49.02 52.58,52.58 52.83,52.83 | 52.83,52.83 R315.1 | 53.34,48.77 R317.1 | 52.83,40.13 R321.1 | 52.83,40.13 52.58,39.88 52.58,36.58 52.83,36.32 53.34,36.32 | 34.54,36.83 47.5,36.83 49.28,35.05 52.83,35.05 53.34,35.56 53.34,36.32 | 53.34,36.32 R323.1
  Top 0.203: 52.83,40.13 v55.12,40.13 | 52.83,52.83 v55.12,52.83 | 53.34,10.92 52.83,10.92 52.58,11.18 52.58,14.73 52.83,14.99 | 52.83,14.99 R421.1 | 53.34,10.92 R423.1 | 52.83,14.99 v55.12,14.99 | U202.21 43.33,86.76 v43.18,86.61
  Top 0.61: C201.1 17.02,90.17 17.08,90.24 C202.2 17.08,88.97 16,87.88 J202.3 | J201.5 9.22,88.82 9.65,88.39 9.65,86.11 10.92,84.84 12.95,84.84 v13.97,83.82 v15.49,83.82 v17.02,83.82
  Bottom 0.203: U403.4 31.76,17.79 32.26,18.29 40.39,18.29 41.91,16.76 47.5,16.76 48.77,15.49 53.09,15.49 53.43,15.84 R415.1 52.83,17.02 52.58,17.27 52.58,20.83 52.83,21.08 | U401.4 31.76,30.74 32,30.99 | 32,30.99 39.37,30.99 | U302.4 31.76,55.89 32.26,56.39 | 32.26,56.39 38.35,56.39 | 32.26,56.39 40.39,56.39 41.91,54.86 | 41.91,54.86 48.01,54.86 | 32,30.99 40.39,30.99 41.91,29.46 48.77,29.46 49.78,28.45 52.83,28.45 53.34,28.96 53.34,29.72 | 41.91,54.86 49.78,54.86 50.8,53.85 52.58,53.85 53.34,54.61 53.34,55.12 | 52.83,59.18 R311.1 | 52.83,59.18 52.58,58.93 52.58,55.37 52.83,55.12 53.34,55.12 | 53.34,55.12 R309.1 | 52.83,59.18 v55.12,59.18 | 52.83,33.78 R405.1 | 52.83,33.78 52.58,33.53 52.58,29.97 52.83,29.72 53.34,29.72 | 53.59,29.72 R403.1 53.34,29.72 | 52.83,21.08 R417.1 | 52.83,21.08 v55.12,21.08 | 52.83,33.78 53.85,33.78 53.85,34.29 v55.12,35.56 55.37,35.81
  other vias: 4.06,57.4 6.1,57.4 6.1,54.36 4.06,54.36 6.1,51.31 4.06,51.31 6.1,48.26 4.06,45.21 6.1,45.21 4.06,48.26 6.1,42.16 4.06,42.16 4.06,75.18 6.1,75.18 6.1,72.14 4.06,72.14 6.1,69.09 4.06,69.09 6.1,78.23 4.06,78.23 4.06,66.04 6.1,66.04 4.06,33.53 6.1,33.53 6.1,30.48 4.06,30.48 6.1,27.43 4.06,27.43 4.06,24.38 6.1,24.38 6.1,21.34 4.06,21.34 6.1,18.29 4.06,18.29 4.06,15.24 6.1,15.24 6.1,12.19 4.06,12.19 6.1,9.14 4.06,9.14 4.06,6.1 6.1,6.1
  pour Bottom: 0,83.82 11.68,83.82 11.68,0 0,0
  pour Top: 0,83.82 11.68,83.82 11.68,0 0,0
  pour Route15: 0,0 11.43,0 11.43,64.77 48.26,64.77 48.26,0 63.5,0 63.5,96.52 0,96.52
MCU_RXD
  Top 0.203: U201.1 39.3,94.05 39.88,93.47 39.88,90.68 39.9,90.65 U202.30
MCU_TXD
  Top 0.203: U202.31 39.15,93.19 38.86,93.47 31.5,93.47 30.99,92.96 30.99,91.95 30.48,91.44 27.43,91.44 27.18,91.69 27.18,93.73 27.28,93.83 U201.5
MISO  (via drill 0.41)
  Top 0.203: U202.16 v43.95,78.24 v43.94,78.23
  Bottom 0.203: v43.94,78.23 43.94,72.9 J203.1
MOSI  (via drill 0.41)
  Top 0.203: U202.15 43.15,79.53 v43.18,79.5
  Bottom 0.203: v43.18,79.5 43.18,74.17 42.42,73.41 42.42,71.12 41.4,70.1 J203.4
N$7
  Top 0.203: U303.8 33.78,51.82 34.54,51.05 40.64,51.05 42.16,52.58 51.56,52.58 51.82,52.83 R315.2 51.73,51.9 51.82,51.82 51.73,51.73 R316.1
N$9
  Top 0.203: U301.8 33.78,64.52 34.54,63.75 51.05,63.75 51.31,64.01 R304.1 51.82,64.01 51.73,64.1 | 51.73,64.35 51.82,64.26 | 51.73,64.1 51.73,64.35 | 51.73,64.35 R303.2 | 51.73,64.35 51.56,64.35 51.56,64.1 51.73,64.1
N$10
  Top 0.203: U301.9 33.28,65.29 33.27,65.28 33.27,64.26 34.29,63.25 51.05,63.25 51.56,62.74 R306.1 51.73,61.56 51.82,61.47 R305.2
N$11
  Top 0.203: U303.9 33.28,51.55 34.29,50.55 40.64,50.55 42.16,49.02 51.56,49.02 51.73,48.86 R317.2 51.73,49.95 51.82,50.04 R318.1
N$12
  Top 0.203: U201.17 22.73,85.72 22.35,85.34 21.84,85.34 21.34,84.84 21.34,84.33 C204.1
N$13
  Top 0.61: J201.1 9.47,92.02 10.16,92.71 10.16,94.23 10.92,95 16,95 16.83,94.17 C201.2 19.24,94.17 | 19.24,94.17 L201.1 | 19.24,94.17 19.3,94.23
N$14
  Top 0.203: J201.2 10.88,91.22 11.18,90.93 11.18,86.87 11.68,86.36 19.56,86.36 20.07,86.87 20.07,88.14 20.57,88.65 21.84,88.65 22.1,88.39 22.1,86.87 22.08,86.85 U201.16
N$15
  Top 0.203: U201.15 21.43,85.94 21.08,85.6 11.43,85.6 10.41,86.61 10.41,90.17 10.16,90.42 J201.3
N$16
  Top 0.203: U202.7 33.98,84.36 X1.4 34.04,84.28 C205.1
N$17
  Top 0.203: C206.1 32,87.12 32.34,86.78 31.54,86.78 30.99,86.23 30.99,84.49 X1.1 31.12,83.95 31.37,83.95 32.26,83.06 35.94,83.06 36.44,83.56 U202.8
N$19
  Top 0.203: U304.8 33.78,39.12 34.54,38.35 50.8,38.35 51.31,38.86 R322.1 51.82,38.86 51.73,38.95 R321.2
N$20
  Top 0.203: U304.9 33.28,38.85 34.29,37.85 50.8,37.85 51.31,37.34 51.82,37.34 51.73,37.43 R324.1 | R324.1 R323.2 | R324.1 51.73,37.68 | R324.1 51.82,37.59
N$22
  Bottom 0.203: U302.8 32.26,58.17 32.51,57.91 40.39,57.91 41.91,59.44 47.75,59.44 48.26,58.93 50.55,56.9 51.05,56.39 R310.1 | 51.73,54.95 R309.2 | R310.1 51.73,54.95 | 51.73,54.95 51.82,54.86 | R310.1 51.82,56.39
N$23
  Bottom 0.203: U302.9 32.76,58.68 33.02,58.42 40.13,58.42 41.66,59.94 48.01,59.94 50.8,57.4 51.31,57.4 51.82,57.91 R312.1 51.73,58 | 51.56,57.91 51.73,58.08 51.82,58.08 | 51.73,58 51.56,58.17 51.73,58.33 R311.2 | 51.82,58.08 51.82,58.17 | 51.73,58 51.82,58 51.82,58.08
N$25
  Bottom 0.203: U401.8 32.26,33.02 32.77,32.51 40.39,32.51 41.91,34.04 50.29,34.04 50.8,33.53 50.8,31.24 51.05,30.99 R404.1 | R403.2 51.73,29.81 51.56,29.97 51.73,30.14 R404.1 | R404.1 51.82,30.99
N$26
  Bottom 0.203: U401.9 32.76,33.28 33.02,33.02 40.13,33.02 41.66,34.54 47.5,34.54 | 47.5,34.54 48.01,34.54 | 51.82,33.78 R406.1 | 51.82,33.78 51.73,33.69 51.73,32.68 51.56,32.51 51.82,32.51 | 51.82,33.78 R405.2 | 47.5,34.54 51.05,34.54 51.82,33.78
N$28
  Bottom 0.203: U403.8 32.26,20.07 32.51,19.81 40.39,19.81 41.91,21.34 50.04,21.34 50.55,20.83 50.55,19.3 51.56,18.29 R416.1 51.73,18.12 51.82,18.03 51.73,17.95 R415.2
N$29
  Bottom 0.203: U403.9 32.76,20.58 33.02,20.32 40.13,20.32 41.66,21.84 50.8,21.84 51.56,21.08 R417.2 51.82,21.08 51.73,20.99 R418.1
N$31
  Top 0.203: U404.8 33.78,13.72 34.54,12.95 40.64,12.95 42.16,14.48 46.48,14.48 47.5,13.46 51.82,13.46 | 51.82,14.73 51.82,14.99 R421.2 51.73,14.82 51.82,14.73 | 51.82,13.46 51.82,14.73 | 51.82,13.46 51.82,13.72 R422.1 51.73,13.88 51.82,13.46
N$32
  Top 0.203: U404.9 33.28,13.45 34.29,12.45 40.64,12.45 42.16,10.92 51.31,10.92 51.56,10.67 51.73,10.83 R423.2 51.73,12.1 51.82,12.19 R424.1
N$34
  Top 0.203: U402.8 33.78,26.42 34.54,25.65 40.64,25.65 42.16,27.18 51.31,27.18 51.82,27.69 | 51.82,27.69 51.73,27.6 R409.2 51.82,27.69 | R410.1 51.82,26.42 51.82,27.69
N$35
  Top 0.203: U402.9 33.28,26.15 34.29,25.15 40.64,25.15 42.16,23.62 R411.2 | 51.73,24.8 R412.1 51.73,23.96 51.82,23.88 51.73,23.79 R411.2 | R411.2 51.82,23.62
PC0  (via drill 0.41)
  Top 0.203: U301.3 33.78,62.23 34.29,62.74 48.77,62.74 v49.53,61.98 | v59.44,61.98 59.44,62.48 58.93,62.99 58.93,87.88 58.42,88.39 45.47,88.39 U202.23
  Bottom 0.203: v49.53,61.98 v59.44,61.98
PC1  (via drill 0.41)
  Top 0.203: U202.24 43.95,89.16 v43.18,89.15 | v61.98,55.12 61.98,58.67 62.48,59.18 62.48,63.25 61.47,64.26 61.47,82.8 61.98,83.57 61.98,84.84 61.21,85.6 v61.21,87.63
  Bottom 0.203: U302.3 32.26,55.63 32.51,55.88 40.13,55.88 41.66,54.36 49.53,54.36 50.55,53.34 53.85,53.34 54.61,54.1 61.21,54.1 61.72,54.61 v61.98,55.12 | v43.18,89.15 43.18,88.9 44.45,87.63 v61.21,87.63
PC2  (via drill 0.41)
  Top 0.203: U303.3 33.78,49.53 34.29,50.04 40.39,50.04 41.91,48.51 | 41.91,48.51 48.01,48.51 | 41.91,48.51 48.77,48.51 v49.53,47.75 | U202.25 43.95,90.93 43.94,90.93 44.45,91.44 45.97,91.44 46.48,90.93 46.48,89.66 47.24,88.9 58.67,88.9 59.44,88.14 59.44,63.25 60.2,62.48 60.2,61.47 59.94,61.21 59.44,61.21 58.93,60.71 58.93,49.02 59.44,48.51 v59.44,47.75
  Bottom 0.203: v49.53,47.75 v59.44,47.75
PC3  (via drill 0.41)
  Top 0.203: U304.3 33.78,36.83 34.29,37.34 48.01,37.34 48.51,36.83 v49.53,36.83 | U202.26 43.15,90.46 43.18,90.42 43.18,91.69 43.43,91.95 46.23,91.95 46.99,91.19 46.99,89.92 47.5,89.41 58.93,89.41 59.94,88.39 59.94,63.5 60.71,62.74 60.71,61.21 60.2,60.71 59.69,60.71 59.44,60.45 59.44,49.28 60.2,48.51 60.2,47.24 59.94,46.99 59.18,46.99 58.93,46.74 58.93,37.59 v59.69,36.83
  Bottom 0.203: v49.53,36.83 v59.69,36.83
PD4  (via drill 0.41)
  Top 0.203: U202.2 38.83,88.36 v38.86,88.39 | v55.12,75.44 55.88,75.95 57.15,75.95 57.4,75.69 57.4,28.19 57.15,27.94 v55.12,27.94
  Bottom 0.203: U401.3 32.26,30.23 32.51,30.48 40.13,30.48 41.66,28.96 | 41.66,28.96 48.01,28.96 | 41.66,28.96 48.51,28.96 49.53,27.94 v55.12,27.94 | v38.86,88.39 42.93,88.39 44.2,87.12 56.39,87.12 56.64,86.87 56.64,76.71 55.37,75.44 v55.12,75.44
PD5  (via drill 0.41)
  Top 0.203: U402.3 33.78,24.13 34.29,24.64 40.39,24.64 41.91,23.11 | 41.91,23.11 48.01,23.11 | 41.91,23.11 48.51,23.11 49.02,22.61 v49.53,22.61 | v55.12,22.61 57.4,22.61 57.91,23.11 57.91,75.95 57.4,76.45 38.86,76.45 38.35,76.96 38.35,82.04 38.35,82.05 U202.9
  Bottom 0.203: v49.53,22.61 v55.12,22.61
PD6  (via drill 0.41)
  Top 0.203: U202.10 39.15,80.3 v39.12,80.26 | v49.53,67.06 56.64,67.06 56.9,66.8 56.9,29.46 56.64,29.21 v55.12,29.21
  Bottom 0.203: U403.3 32.26,17.53 32.51,17.78 40.13,17.78 41.66,16.26 47.24,16.26 48.51,14.99 53.34,14.99 54.36,16 61.47,16 62.23,16.76 62.23,28.45 61.47,29.21 v55.12,29.21 | 49.78,67.31 v49.53,67.06 40.39,67.06 39.88,67.56 39.88,75.95 39.12,76.71 v39.12,80.26
PD7  (via drill 0.41)
  Top 0.203: U404.3 33.78,11.43 34.29,11.94 40.39,11.94 41.91,10.41 | 41.91,10.41 48.01,10.41 | 41.91,10.41 48.77,10.41 49.28,9.91 v49.53,9.91 | v58.42,9.91 58.42,76.2 57.66,76.96 40.89,76.96 39.88,77.98 39.88,82.04 39.9,82.07 U202.11
  Bottom 0.203: v49.53,9.91 v58.42,9.91
SCK  (via drill 0.41)
  Top 0.203: U202.17 46.74,83.56 46.99,83.31 v46.99,77.98 | v46.99,74.93 43.43,74.93 J203.3
  Bottom 0.203: v46.99,74.93 v46.99,77.98
SCL  (via drill 0.41)
  Top 0.203: U303.6 34.78,52.34 35.05,52.07 40.13,52.07 41.66,53.59 49.02,53.59 49.53,54.1 v49.53,55.63 53.34,55.63 v55.12,57.91 | U304.6 34.78,39.64 35.05,39.37 | 35.05,39.37 40.64,39.37 | U402.6 34.78,26.94 35.05,26.67 40.13,26.67 41.66,28.19 48.01,28.19 v49.53,29.97 49.53,31.5 51.05,33.02 v55.12,33.02 | U404.6 34.78,14.24 35.05,13.97 40.13,13.97 41.66,15.49 46.99,15.49 49.02,17.53 v49.53,17.53 50.29,17.53 50.55,17.27 v55.12,17.27 | R202.1 48.51,92.46 46.99,93.98 42.67,93.98 | 42.67,93.98 42.42,93.98 41.4,92.96 v41.4,92.46 41.55,92.31 41.55,90.79 41.66,90.68 41.63,90.65 U202.28 | 42.67,93.98 53.09,93.98 53.85,93.22 53.85,90.42 54.36,89.92 59.18,89.92 60.45,88.65 60.45,63.75 61.21,62.99 61.21,60.96 60.2,59.94 v60.2,59.69 60.2,59.18 59.94,58.93 59.94,49.53 60.71,48.77 60.71,46.99 60.2,46.48 59.69,46.48 59.44,46.23 59.44,42.42 59.69,42.16 v59.69,41.91 59.69,41.4 59.44,41.15 59.44,38.35 60.45,37.34 60.45,36.32 59.69,35.56 v59.69,33.02 58.93,32.26 58.93,17.27 v59.18,17.27 | 35.05,39.37 46.99,39.37 v49.53,41.91 | U301.6 34.78,66.56 34.29,67.06 31.75,67.06 v31.24,66.55
  Bottom 0.203: U403.6 31.26,19.54 32,18.8 40.64,18.8 42.16,17.27 v49.53,17.53 | U401.6 31.26,32.5 32.26,31.5 40.64,31.5 42.16,29.97 | 42.16,29.97 48.01,29.97 | v49.53,55.63 49.28,55.37 42.16,55.37 40.64,56.9 31.75,56.9 31.26,57.39 U302.6 31.26,59.2 31.24,59.18 v31.24,66.55 | v55.12,17.27 v59.18,17.27 | v59.69,33.02 v55.12,33.02 | v49.53,29.97 42.16,29.97 | v59.69,41.91 v49.53,41.91 | v60.2,59.69 60.45,59.69 58.67,57.91 v55.12,57.91 | v41.4,92.46 39.88,90.93 25.15,90.93 24.64,90.42 J202.2
SDA  (via drill 0.41)
  Top 0.203: U301.7 34.28,64.78 34.8,64.26 48.51,64.26 v49.53,65.28 | U303.7 34.28,52.08 34.8,51.56 40.39,51.56 41.91,53.09 49.53,53.09 51.56,55.12 v55.12,55.12 | U304.7 34.28,39.38 34.8,38.86 | 34.8,38.86 40.64,38.86 | U402.7 34.28,26.68 34.8,26.16 40.39,26.16 41.91,27.69 | 41.91,27.69 48.01,27.69 | U404.7 34.28,13.98 34.8,13.46 40.39,13.46 41.91,14.99 47.24,14.99 48.01,14.22 v49.53,14.22 v49.53,16.26 | v42.42,92.46 42.67,92.46 | v42.42,92.46 42.35,92.39 U202.27 42.39,90.65 42.42,90.68 42.42,85.09 v43.18,84.33 | v42.42,92.46 42.16,92.46 | 48.43,90.51 48.51,90.42 | 48.43,90.51 R201.1 | 48.43,90.51 46.48,92.46 v42.42,92.46 | v58.17,84.33 v55.12,84.33 | v61.21,84.33 61.21,83.31 60.96,83.06 60.96,64.01 61.72,63.25 v61.72,59.69 60.71,58.67 v60.71,55.12 60.71,54.61 60.45,54.36 60.45,49.78 61.21,49.02 61.21,46.74 60.45,45.97 60.2,45.97 59.94,45.72 59.94,43.18 60.2,42.93 60.45,42.93 60.71,42.67 60.71,41.15 59.94,40.39 59.94,38.61 60.96,37.59 v60.96,34.29 60.96,33.02 59.44,31.5 59.44,18.29 59.94,17.53 59.94,17.02 59.18,16 v59.18,13.72 | 34.8,38.86 48.26,38.86 49.28,39.88 v49.53,39.88 | v49.53,59.69 v49.53,56.9 | 49.02,34.29 v47.24,36.07 | 49.02,34.29 v55.12,34.29 56.13,34.29 56.39,34.04 56.39,32 56.13,31.75 v55.12,31.75 53.59,31.75 49.53,27.69 41.91,27.69 | v49.53,59.69 v49.53,56.9 | v49.53,59.69 v49.53,56.9 | v49.53,59.69 54.1,59.69 v55.12,60.71 | v49.53,32.77 49.53,33.78 49.02,34.29
  Bottom 0.203: U403.7 31.76,19.8 32.26,19.3 40.64,19.3 42.16,20.83 | U401.7 31.76,32.76 32.51,32 | 32.51,32 39.37,32 | U302.7 31.76,57.65 32,57.4 | 32,57.4 38.35,57.4 | 32,57.4 40.64,57.4 42.16,58.93 47.24,58.93 v49.53,56.9 | 32.51,32 40.64,32 42.16,33.53 48.77,33.53 v49.53,32.77 | 42.16,20.83 48.01,20.83 | v42.42,92.46 42.42,92.96 41.91,93.47 40.64,93.47 40.13,92.96 J202.1 | v61.21,84.33 v58.17,84.33 | v59.18,13.72 49.28,13.72 v49.53,14.22 | 42.16,20.83 49.78,20.83 50.04,20.57 50.04,19.05 50.8,18.29 50.8,16.76 50.29,16.26 v49.53,16.26 | v47.24,36.07 47.24,37.85 49.28,39.88 v49.53,39.88 | v60.71,55.12 v55.12,55.12 | v49.53,65.28 48.26,64.01 48.26,60.96 v49.53,59.69 | v60.96,34.29 v55.12,34.29 | v55.12,84.33 v43.18,84.33 | v55.12,60.71 60.71,60.71 v61.72,59.69
SIG1  (via drill 1.36)
  Top 1.422: J102.6 19.05,78.14 v19.05,78.23
  Bottom 1.422: J102.6 19.05,78.14 v19.05,78.23
SIG2  (via drill 1.36)
  Top 1.422: J102.7 19.05,75.14 v19.05,75.18
  Bottom 1.422: J102.7 v19.05,75.18
SIG3  (via drill 1.36)
  Top 1.422: v19.05,72.14 J102.8
  Bottom 1.422: J102.8 v19.05,72.14
SIG4  (via drill 1.36)
  Top 1.422: J102.9 19.05,69.14 v19.05,69.09
  Bottom 1.422: J102.9 19.05,69.14 v19.05,69.09
SIG5  (via drill 1.36)
  Top 1.422: J102.10 19.05,66.14 v19.05,66.04
  Bottom 1.422: J102.10 19.05,66.14 v19.05,66.04
V0_IN
  Top 0.305: U301.1 32.77,61.39 32.77,57.15 R301.P$1 28.19,57.15
  pour Top: 13.46,53.59 16.51,53.59 16.51,54.36 31.5,54.36 31.5,59.94 16.51,59.94 16.51,57.91 13.46,57.91
V0_OUT  (via drill 1.36)
  Top 0.305: U301.2 33.27,57.15 38.86,57.15
  other vias: 43.18,57.15 45.21,57.15 20.83,57.15 22.86,57.15
  pour Bottom (rank 2): 13.46,53.59 16.51,53.59 16.51,54.36 25.15,54.36 25.15,60.71 16.51,60.71 16.51,57.91 13.46,57.91
  pour Route2: 12.7,51.05 45.72,51.05 45.72,63.5 12.7,63.5
  pour Top: 34.54,59.94 47.75,59.94 47.75,54.36 34.54,54.36
V1_IN  (via drill 1.36)
  Bottom 0.305: U302.1 33.27,55.04 33.27,50.8 R307.P$1
  other vias: 20.83,50.8 22.86,50.8 43.18,50.8 45.21,50.8
  pour Route15: 12.7,44.45 45.72,44.45 45.72,57.15 12.7,57.15
  pour Bottom: 34.54,53.59 47.75,53.59 47.75,48.01 34.54,48.01
  pour Top (rank 2): 13.46,47.5 16.51,47.5 16.51,48.01 25.15,48.01 25.15,53.59 16.51,53.59 16.51,52.07 13.46,52.07
V1_OUT
  Bottom 0.305: U302.2 32.77,50.8 R307.P$2
  pour Bottom: 13.46,47.5 16.51,47.5 16.51,48.01 20.83,48.01 31.5,48.01 31.5,53.59 16.51,53.59 16.51,52.07 13.46,52.07
V2_IN
  Top 0.305: U303.1 32.77,48.69 32.77,44.45 R313.P$1 28.19,44.45
  pour Top: 13.46,41.66 31.5,41.66 31.5,47.24 16.51,47.24 16.51,45.97 13.46,45.97
V2_OUT  (via drill 1.36)
  Top 0.305: U303.2 33.27,44.45 R313.P$2
  other vias: 43.18,44.45 45.21,44.45 20.83,44.45 22.86,44.45
  pour Bottom (rank 2): 13.46,41.66 25.15,41.66 25.15,47.24 16.51,47.24 16.51,45.97 13.46,45.97
  pour Route2: 12.7,38.35 45.72,38.35 45.72,50.55 12.7,50.55
  pour Top: 34.54,47.24 47.75,47.24 47.75,41.66 34.54,41.66
V3_IN
  Top 0.305: U304.1 32.77,35.99 32.77,31.75 R319.P$1 28.19,31.75
  pour Top: 13.46,29.72 16.51,29.72 16.51,28.96 31.5,28.96 31.5,34.54 16.51,34.54 16.51,34.04 13.46,34.04
V3_OUT  (via drill 1.36)
  Top 0.305: U304.2 33.27,31.75 R319.P$2 37.85,31.75
  other vias: 20.83,31.75 22.86,31.75 43.18,31.75 45.21,31.75
  pour Bottom (rank 2): 13.46,29.72 16.51,29.72 16.51,28.96 25.15,28.96 25.15,34.54 16.51,34.54 16.51,34.04 13.46,34.04
  pour Route2: 12.7,25.65 45.72,25.65 45.72,37.85 12.7,37.85
  pour Top: 34.54,34.8 47.75,34.8 47.75,28.96 34.54,28.96
V4_IN  (via drill 1.36)
  Bottom 0.305: U401.1 33.27,29.64 33.27,25.4 R401.P$1
  other vias: 20.83,25.4 22.86,25.4 43.18,25.4 45.21,25.4
  pour Top (rank 2): 13.46,27.94 13.46,23.62 16.51,23.62 16.51,22.61 25.15,22.61 25.15,28.19 16.51,28.19 16.51,27.94
  pour Route15: 12.7,19.3 45.72,19.3 45.72,31.75 12.7,31.75
  pour Bottom: 34.54,28.19 47.75,28.19 47.75,22.61 34.54,22.61
V4_OUT
  Bottom 0.305: U401.2 32.77,25.4 R401.P$2 28.19,25.4
  pour Bottom: 13.46,27.94 13.46,23.62 16.51,23.62 16.51,22.61 31.5,22.61 31.5,28.19 16.51,28.19 16.51,27.94
V5_IN
  Top 0.305: U402.1 32.77,23.29 32.77,19.05 R407.P$1 28.19,19.05
  pour Top: 13.46,17.78 16.51,17.78 16.51,16.26 31.5,16.26 31.5,21.84 16.51,21.84 16.51,22.1 13.46,22.1
V5_OUT  (via drill 1.36)
  Top 0.305: U402.2 33.27,19.05 R407.P$2 38.1,19.05
  other vias: 20.83,19.05 22.86,19.05 43.18,19.05 45.21,19.05
  pour Route2: 12.7,12.95 45.72,12.95 45.72,25.15 12.7,25.15
  pour Bottom (rank 2): 13.46,17.78 16.51,17.78 16.51,16.26 25.15,16.26 25.15,21.84 16.51,21.84 16.51,22.1 13.46,22.1
  pour Top: 34.54,21.84 47.75,21.84 47.75,16.26 34.54,16.26
V6_IN  (via drill 1.36)
  Bottom 0.305: U403.1 33.27,16.94 33.27,12.7 R413.P$1
  other vias: 22.86,12.7 20.83,12.7 43.18,12.7 45.21,12.7
  pour Top (rank 2): 25.15,9.91 25.15,15.49 16.51,15.49 16.51,16 13.46,16 13.46,11.68 16.51,11.68 16.51,9.91
  pour Bottom: 34.54,15.49 47.75,15.49 47.75,9.91 34.54,9.91
  pour Route15: 12.7,6.35 45.72,6.35 45.72,18.8 12.7,18.8
V6_OUT
  Bottom 0.305: U403.2 32.77,12.7 R413.P$2 28.19,12.7
  pour Bottom: 31.5,9.91 31.5,15.49 16.51,15.49 16.51,16 13.46,16 13.46,11.68 16.51,11.68 16.51,9.91
V7_IN
  Top 0.305: U404.1 32.77,10.59 32.77,6.35 R419.P$1
  pour Top: 13.46,9.91 16.51,9.91 16.51,9.14 31.5,9.14 31.5,3.56 13.46,3.56 13.46,9.65
V7_OUT  (via drill 1.36)
  Top 0.305: U404.2 33.27,6.35 R419.P$2 37.85,6.35
  other vias: 20.83,6.35 22.86,6.35 43.18,6.35 45.21,6.35
  pour Route2: 12.7,0.25 45.72,0.25 45.72,12.45 12.7,12.45
  pour Bottom (rank 2): 13.46,9.91 16.51,9.91 16.51,9.14 25.15,9.14 25.15,3.56 13.46,3.56
  pour Top: 34.54,9.14 47.75,9.14 47.75,3.56 34.54,3.56

### Text on the board
tNames: EVAL DEVICE. PROPERTY OF RENCI. | Renci Open Source License 1.0 | (c) 2008, Renci | S/N